# EAGLE design DDS (EAGLE 9.6.2)

## Sheet 1 of 3
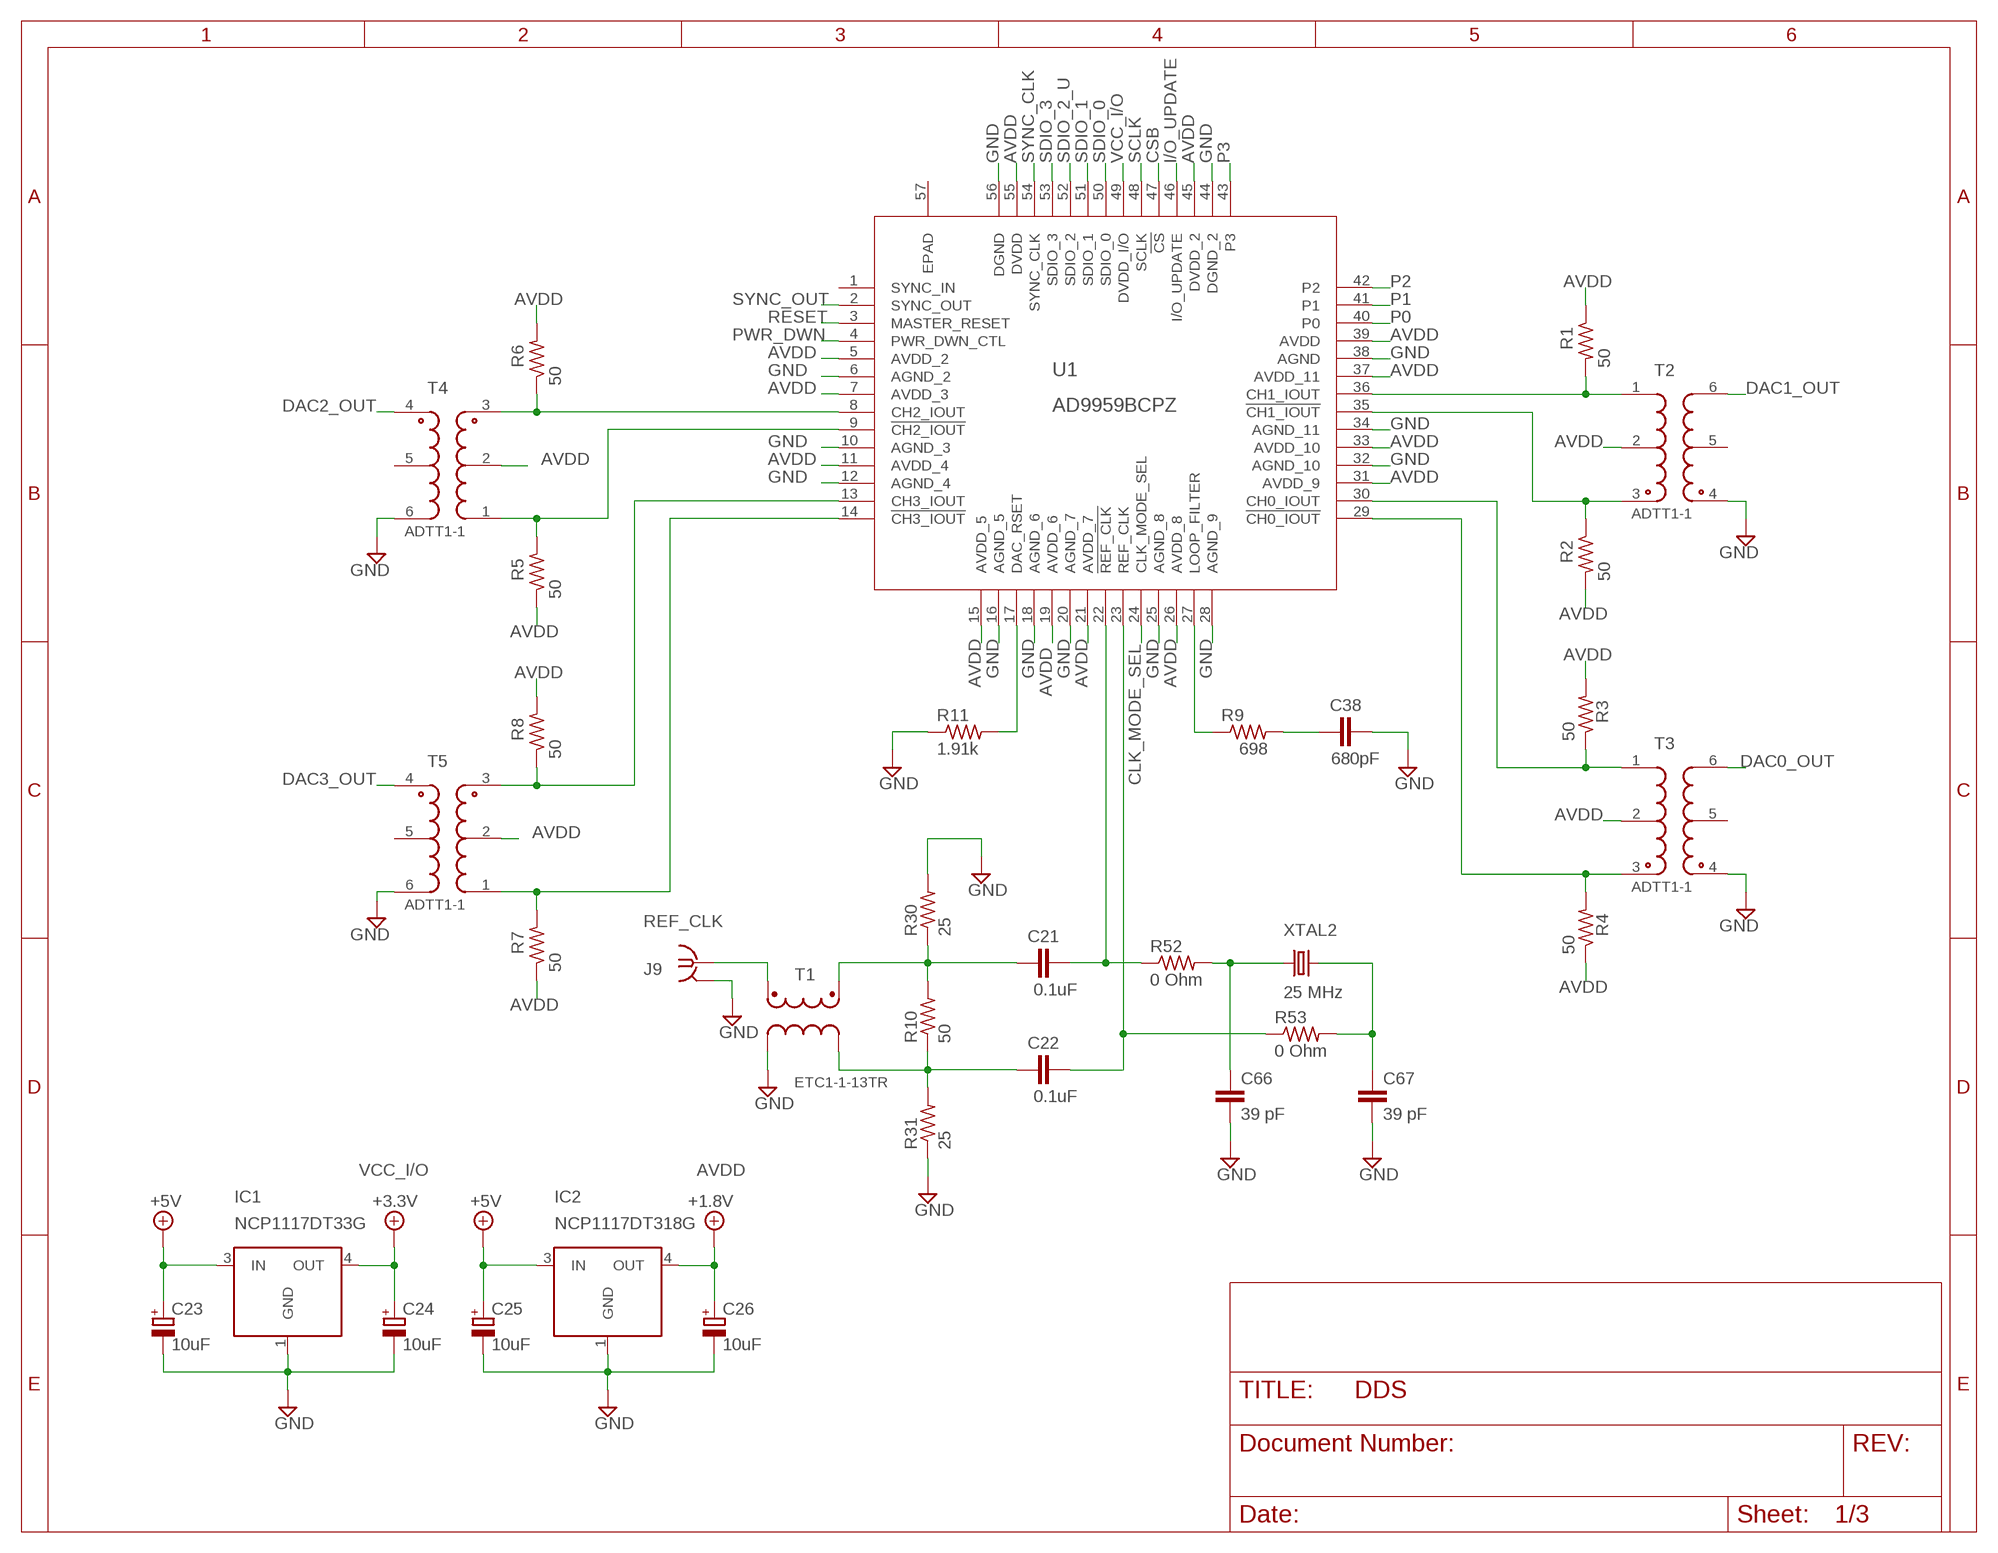
[diagram p0: schematic, sheet 1]

### Parts
C21  0.1uF  C-EUC0402  [C0402]
C22  0.1uF  C-EUC0402  [C0402]
C23  10uF  CPOL-EUCT3528  [CT3528]
C24  10uF  CPOL-EUCT3528  [CT3528]
C25  10uF  CPOL-EUCT3528  [CT3528]
C26  10uF  CPOL-EUCT3528  [CT3528]
C38  680pF  C-EUC0805  [C0805]
C66  39 pF  C-EUC0805  [C0805]
C67  39 pF  C-EUC0805  [C0805]
IC1  NCP1117DT33G  NCP1117DT  [D-PAK_TO252AA]
IC2  NCP1117DT318G  NCP1117DT  [D-PAK_TO252AA]
J9  REF_CLK  BU-SMA-V  [BU-SMA-V]
R1  50  R-US_R0603  [R0603]
R2  50  R-US_R0603  [R0603]
R3  50  R-US_R0603  [R0603]
R4  50  R-US_R0603  [R0603]
R5  50  R-US_R0603  [R0603]
R6  50  R-US_R0603  [R0603]
R7  50  R-US_R0603  [R0603]
R8  50  R-US_R0603  [R0603]
R9  698  R-US_R0603  [R0603]
R10  50  R-US_R0603  [R0603]
R11  1.91k  R-US_R0603  [R0603]
R30  25  R-US_R0402  [R0402]
R31  25  R-US_R0402  [R0402]
R52  0 Ohm  R-US_R0402  [R0402]
R53  0 Ohm  R-US_R0402  [R0402]
T1  ETC1-1-13TR  [SM22]
T2  ADTT1-1  [ADTT]
T3  ADTT1-1  [ADTT]
T4  ADTT1-1  [ADTT]
T5  ADTT1-1  [ADTT]
U1  AD9959BCPZ  [CP_56_1_ADI]
XTAL2  25 MHz  CRYSTALHC49UP  [HC49UP]

### Nets
+5V: C23.+ C25.+ IC1.3(IN) IC2.3(IN) ; also sheet 2
AVDD [1.8V]: C26.+ IC2.4(OUT) R1.1 R2.2 R3.2 R4.1 R5.1 R6.2 R7.1 R8.2 T2.2(PRI0) T3.2(PRI0) T4.2(PRI0) T5.2(PRI0) U1.5(AVDD_2) U1.7(AVDD_3) U1.11(AVDD_4) U1.15(AVDD_5) U1.19(AVDD_6) U1.21(AVDD_7) U1.26(AVDD_8) U1.31(AVDD_9) U1.33(AVDD_10) U1.37(AVDD_11) U1.39(AVDD) U1.45(DVDD_2) U1.55(DVDD) ; supply symbol labelled +1.8V ; also sheet 2,3
CLK_MODE_SEL: U1.24(CLK_MODE_SEL) ; also sheet 2
CSB: U1.47(!CS) ; also sheet 2
DAC0_OUT: T3.6(SEC-) ; also sheet 3
DAC1_OUT: T2.6(SEC-) ; also sheet 3
DAC2_OUT: T4.4(SEC+) ; also sheet 3
DAC3_OUT: T5.4(SEC+) ; also sheet 3
GND: C23.- C24.- C25.- C26.- C38.2 C66.2 C67.2 IC1.1(GND) IC2.1(GND) J9.2(GND) R11.1 R30.2 R31.1 T1.4 T2.4(SEC+) T3.4(SEC+) T4.6(SEC-) T5.6(SEC-) U1.6(AGND_2) U1.10(AGND_3) U1.12(AGND_4) U1.16(AGND_5) U1.18(AGND_6) U1.20(AGND_7) U1.25(AGND_8) U1.28(AGND_9) U1.32(AGND_10) U1.34(AGND_11) U1.38(AGND) U1.44(DGND_2) U1.56(DGND) ; also sheet 2,3
I/O_UPDATE: U1.46(I/O_UPDATE) ; also sheet 2
N$1: C21.1 R10.2 R30.1 T1.1
N$3: R6.1 T4.3(PRI+) U1.8(CH2_IOUT)
N$4: R5.2 T4.1(PRI-) U1.9(!CH2_IOUT)
N$5: R4.2 T3.3(PRI+) U1.29(!CH0_IOUT)
N$6: R1.2 T2.1(PRI-) U1.36(CH1_IOUT)
N$7: R11.2 U1.17(DAC_RSET)
N$8: R9.1 U1.27(LOOP_FILTER)
N$9: C38.1 R9.2
N$11: R7.2 T5.1(PRI-) U1.14(!CH3_IOUT)
N$17: C66.1 R52.2 XTAL2.1
N$21: R3.1 T3.1(PRI-) U1.30(CH0_IOUT)
N$26: C67.1 R53.2 XTAL2.2
N$29: C21.2 R52.1 U1.22(!REF_CLK)
N$31: C22.1 R10.1 R31.2 T1.3
N$32: J9.1 T1.5
N$33: C22.2 R53.1 U1.23(REF_CLK)
N$41: R8.1 T5.3(PRI+) U1.13(CH3_IOUT)
N$45: R2.1 T2.3(PRI+) U1.35(!CH1_IOUT)
P0: U1.40(P0) ; also sheet 2
P1: U1.41(P1) ; also sheet 2
P2: U1.42(P2) ; also sheet 2
P3: U1.43(P3) ; also sheet 2
PWR_DWN: U1.4(PWR_DWN_CTL) ; also sheet 2
RESET: U1.3(MASTER_RESET) ; also sheet 2
SCLK: U1.48(SCLK) ; also sheet 2
SDIO_0: U1.50(SDIO_0) ; also sheet 2
SDIO_1: U1.51(SDIO_1) ; also sheet 2
SDIO_2_U: U1.52(SDIO_2) ; also sheet 2
SDIO_3: U1.53(SDIO_3) ; also sheet 2
SYNC_CLK: U1.54(SYNC_CLK)
SYNC_OUT: U1.2(SYNC_OUT)
VCC_I/O: C24.+ IC1.4(OUT) U1.49(DVDD_I/O) ; supply symbol labelled +3.3V ; also sheet 2,3
Unconnected: T2.5(SEC0) T3.5(SEC0) T4.5(SEC0) T5.5(SEC0) U1.1(SYNC_IN) U1.57(EPAD)

## Sheet 2 of 3
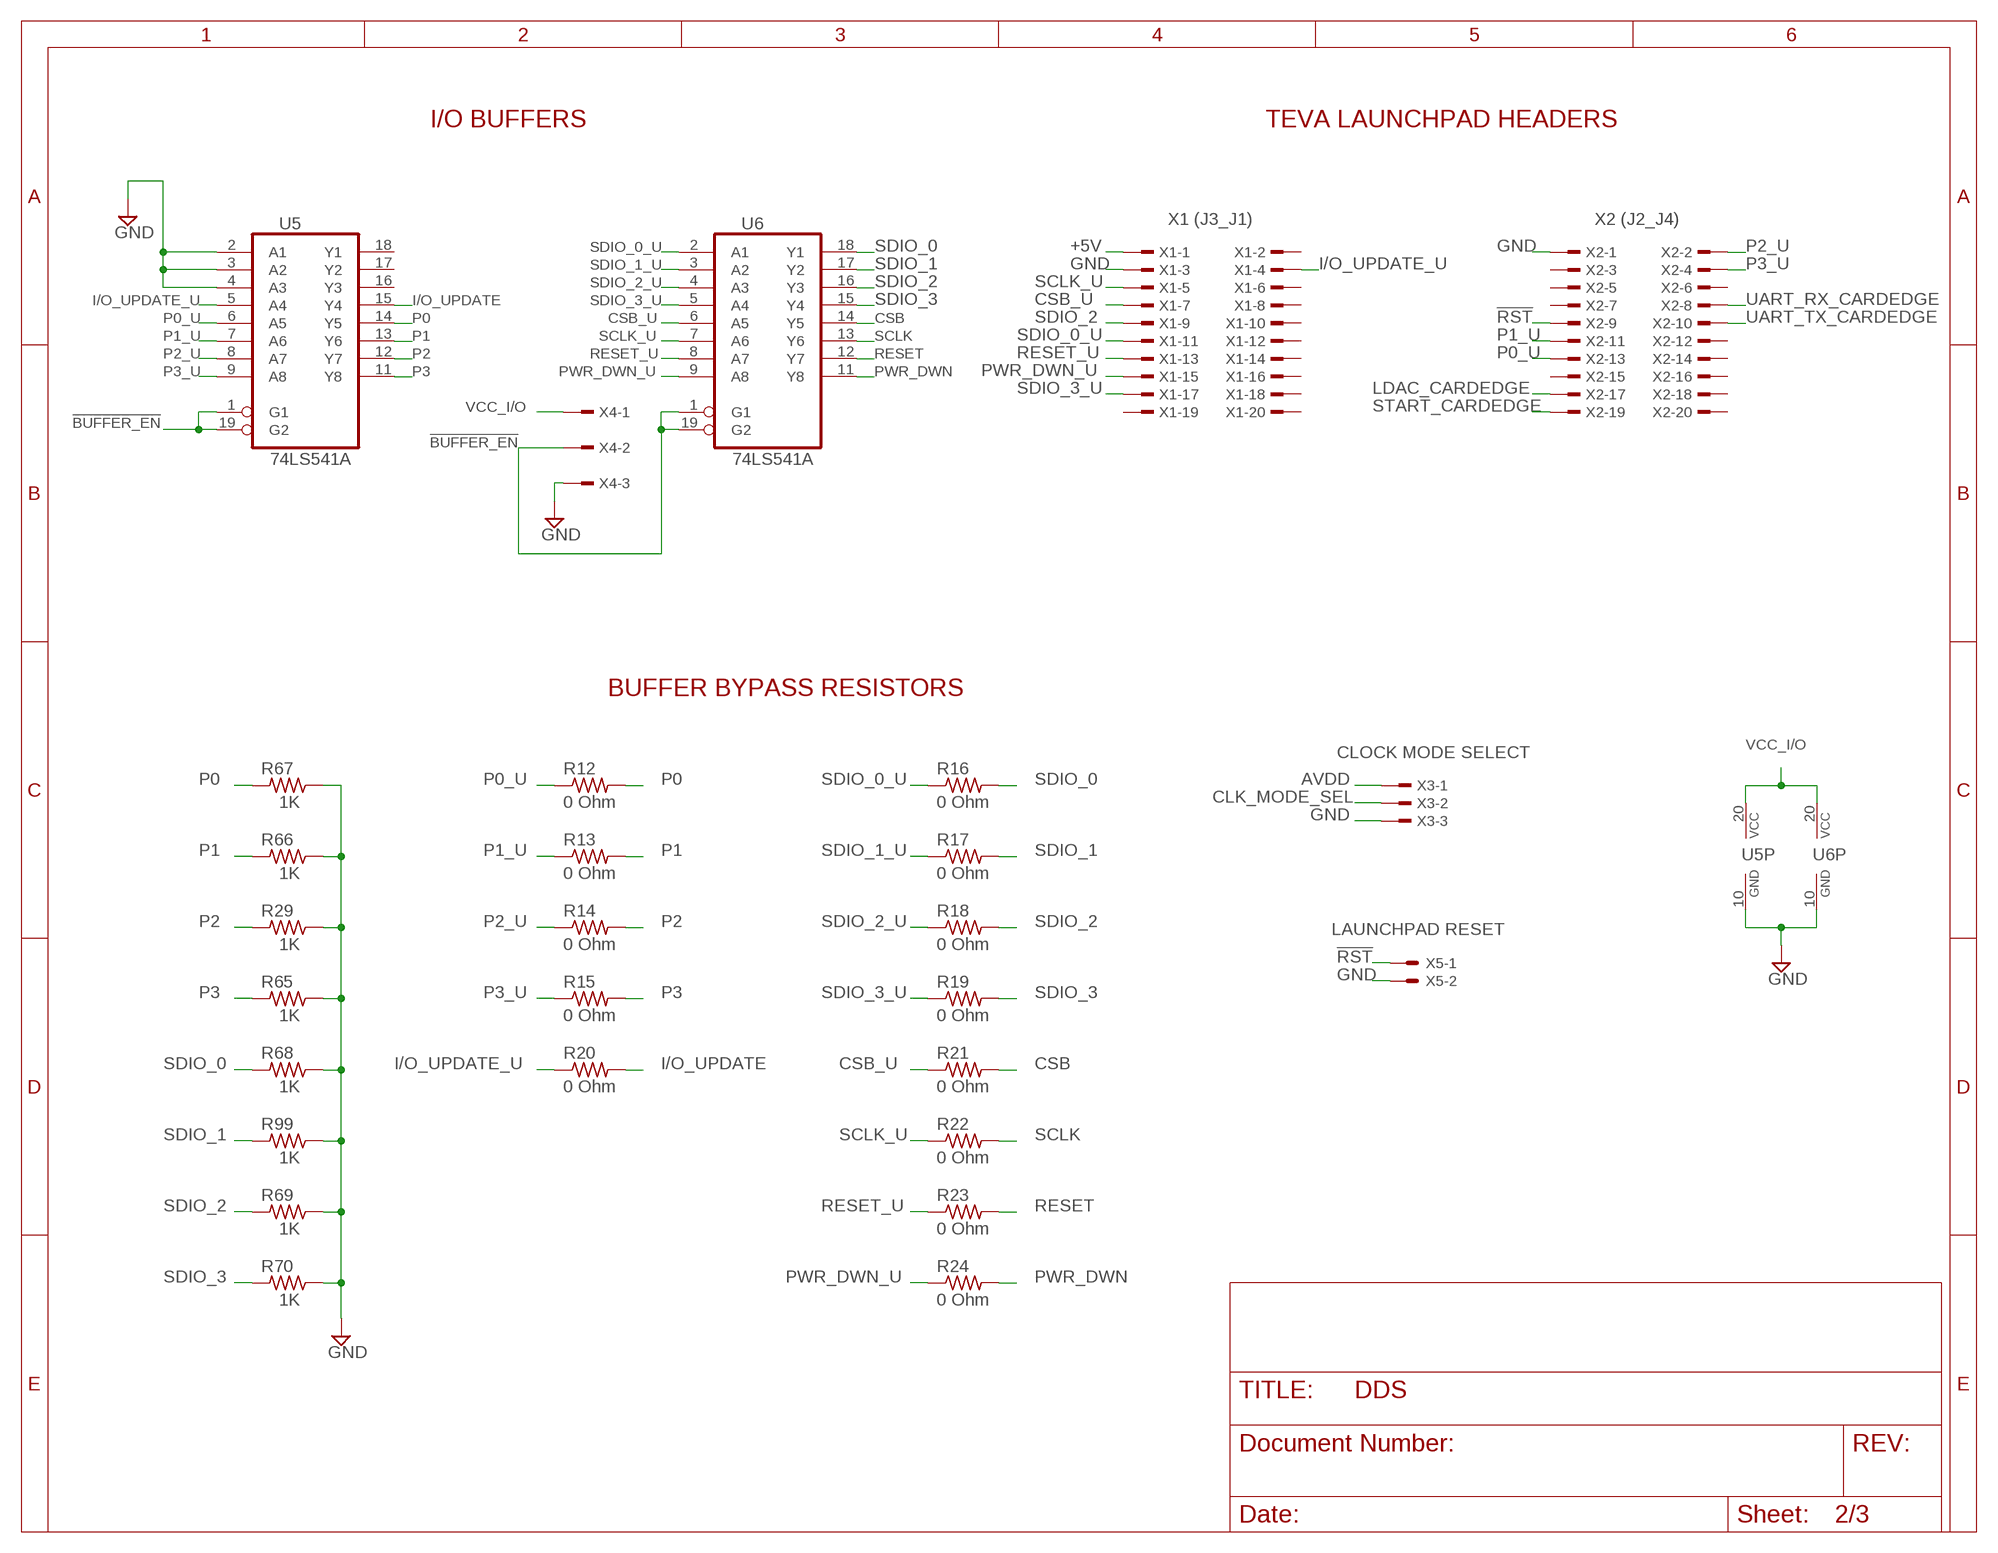
[diagram p1: schematic, sheet 2]

### Parts
R12  0 Ohm  R-US_R0402  [R0402]
R13  0 Ohm  R-US_R0402  [R0402]
R14  0 Ohm  R-US_R0402  [R0402]
R15  0 Ohm  R-US_R0402  [R0402]
R16  0 Ohm  R-US_R0402  [R0402]
R17  0 Ohm  R-US_R0402  [R0402]
R18  0 Ohm  R-US_R0402  [R0402]
R19  0 Ohm  R-US_R0402  [R0402]
R20  0 Ohm  R-US_R0402  [R0402]
R21  0 Ohm  R-US_R0402  [R0402]
R22  0 Ohm  R-US_R0402  [R0402]
R23  0 Ohm  R-US_R0402  [R0402]
R24  0 Ohm  R-US_R0402  [R0402]
R29  1K  R-US_R0603  [R0603]
R65  1K  R-US_R0603  [R0603]
R66  1K  R-US_R0603  [R0603]
R67  1K  R-US_R0603  [R0603]
R68  1K  R-US_R0603  [R0603]
R69  1K  R-US_R0603  [R0603]
R70  1K  R-US_R0603  [R0603]
R99  1K  R-US_R0603  [R0603]
U5  74LS541A  74LS541DW  [SO20W]
U6  74LS541A  74LS541DW  [SO20W]
X1  X1 (J3_J1)  TSW-110-07-G-D  [TSW-110-XX-G-D]
X2  X2 (J2_J4)  TSW-110-07-G-D  [TSW-110-XX-G-D]
X3  CLOCK MODE SELECT  TSW-103-08-G-S  [TSW-103-XX-G-S]
X4  BUFFER  TSW-103-08-G-S  [TSW-103-XX-G-S]
X5  LAUNCHPAD RESET  22-23-2021  [22-23-2021]

### Nets
!BUFFER_EN: U5.1(G1) U5.19(G2) U6.1(G1) U6.19(G2) X4.2
!RST: X2.9 X5.1
+5V: X1.1 ; also sheet 1
AVDD [1.8V]: X3.1 ; also sheet 1,3
CLK_MODE_SEL: X3.2 ; also sheet 1
CSB: R21.2 U6.14(Y5) ; also sheet 1
CSB_U: R21.1 U6.6(A5) X1.7
GND: R29.1 R65.1 R66.1 R67.1 R68.1 R69.1 R70.1 R99.1 U5.2(A1) U5.3(A2) U5.4(A3) U5.10(GND) U6.10(GND) X1.3 X2.1 X3.3 X4.3 X5.2 ; also sheet 1,3
I/O_UPDATE: R20.2 U5.15(Y4) ; also sheet 1
I/O_UPDATE_U: R20.1 U5.5(A4) X1.4
LDAC_CARDEDGE: X2.17
P0: R12.2 R67.2 U5.14(Y5) ; also sheet 1
P0_U: R12.1 U5.6(A5) X2.13
P1: R13.2 R66.2 U5.13(Y6) ; also sheet 1
P1_U: R13.1 U5.7(A6) X2.11
P2: R14.2 R29.2 U5.12(Y7) ; also sheet 1
P2_U: R14.1 U5.8(A7) X2.2
P3: R15.2 R65.2 U5.11(Y8) ; also sheet 1
P3_U: R15.1 U5.9(A8) X2.4
PWR_DWN: R24.2 U6.11(Y8) ; also sheet 1
PWR_DWN_U: R24.1 U6.9(A8) X1.15
RESET: R23.2 U6.12(Y7) ; also sheet 1
RESET_U: R23.1 U6.8(A7) X1.13
SCLK: R22.2 U6.13(Y6) ; also sheet 1
SCLK_U: R22.1 U6.7(A6) X1.5
SDIO_0: R16.2 R68.2 U6.18(Y1) ; also sheet 1
SDIO_0_U: R16.1 U6.2(A1) X1.11
SDIO_1: R17.2 R99.2 U6.17(Y2) ; also sheet 1
SDIO_1_U: R17.1 U6.3(A2)
SDIO_2: R18.2 R69.2 U6.16(Y3) X1.9
SDIO_2_U: R18.1 U6.4(A3) ; also sheet 1
SDIO_3: R19.2 R70.2 U6.15(Y4) ; also sheet 1
SDIO_3_U: R19.1 U6.5(A4) X1.17
START_CARDEDGE: X2.19
UART_RX_CARDEDGE: X2.8
UART_TX_CARDEDGE: X2.10
VCC_I/O: U5.20(VCC) U6.20(VCC) X4.1 ; also sheet 1,3
Unconnected: U5.16(Y3) U5.17(Y2) U5.18(Y1) X1.2 X1.6 X1.8 X1.10 X1.12 X1.14 X1.16 X1.18 X1.19 X1.20 X2.3 X2.5 X2.6 X2.7 X2.12 X2.14 X2.15 X2.16 X2.18 X2.20

### Notes on the sheet
- I/O BUFFERS | TEVA LAUNCHPAD HEADERS
- BUFFER BYPASS RESISTORS

## Sheet 3 of 3
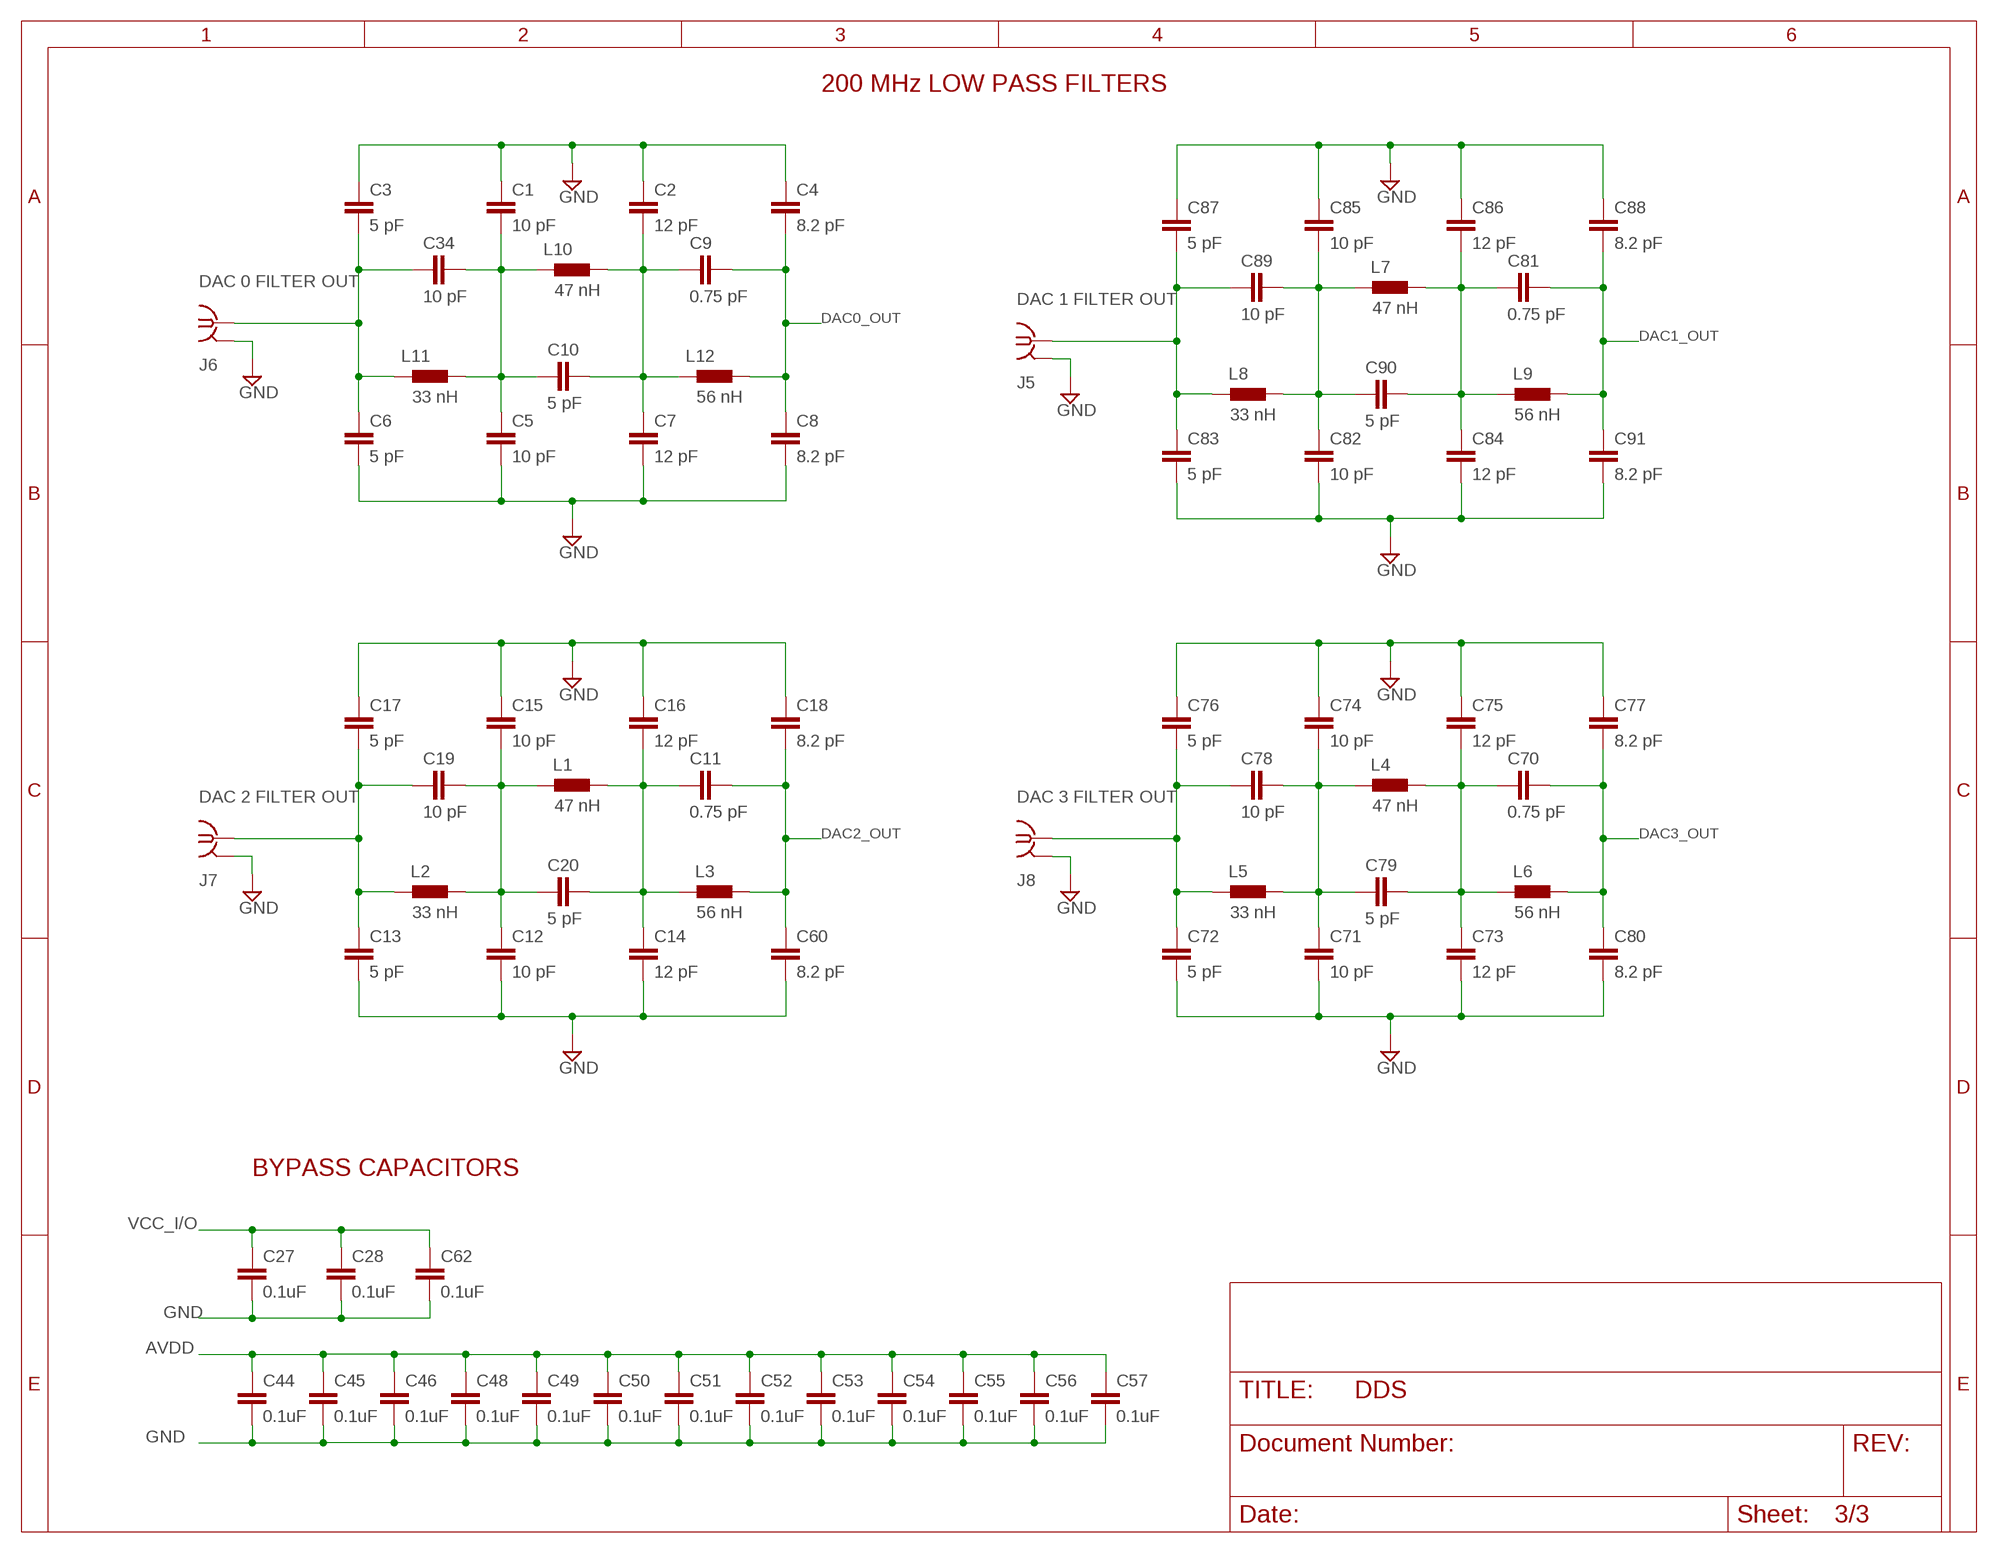
[diagram p2: schematic, sheet 3]

### Parts
C1  10 pF  C-EUC0402  [C0402]
C2  12 pF  C-EUC0402  [C0402]
C3  5 pF  C-EUC0402  [C0402]
C4  8.2 pF  C-EUC0402  [C0402]
C5  10 pF  C-EUC0402  [C0402]
C6  5 pF  C-EUC0402  [C0402]
C7  12 pF  C-EUC0402  [C0402]
C8  8.2 pF  C-EUC0402  [C0402]
C9  0.75 pF  C-EUC0402  [C0402]
C10  5 pF  C-EUC0402  [C0402]
C11  0.75 pF  C-EUC0402  [C0402]
C12  10 pF  C-EUC0402  [C0402]
C13  5 pF  C-EUC0402  [C0402]
C14  12 pF  C-EUC0402  [C0402]
C15  10 pF  C-EUC0402  [C0402]
C16  12 pF  C-EUC0402  [C0402]
C17  5 pF  C-EUC0402  [C0402]
C18  8.2 pF  C-EUC0402  [C0402]
C19  10 pF  C-EUC0402  [C0402]
C20  5 pF  C-EUC0402  [C0402]
C27  0.1uF  C-EUC0603  [C0603]
C28  0.1uF  C-EUC0603  [C0603]
C34  10 pF  C-EUC0402  [C0402]
C44  0.1uF  C-EUC0402  [C0402]
C45  0.1uF  C-EUC0402  [C0402]
C46  0.1uF  C-EUC0402  [C0402]
C48  0.1uF  C-EUC0402  [C0402]
C49  0.1uF  C-EUC0402  [C0402]
C50  0.1uF  C-EUC0402  [C0402]
C51  0.1uF  C-EUC0402  [C0402]
C52  0.1uF  C-EUC0402  [C0402]
C53  0.1uF  C-EUC0402  [C0402]
C54  0.1uF  C-EUC0402  [C0402]
C55  0.1uF  C-EUC0402  [C0402]
C56  0.1uF  C-EUC0402  [C0402]
C57  0.1uF  C-EUC0402  [C0402]
C60  8.2 pF  C-EUC0402  [C0402]
C62  0.1uF  C-EUC0402  [C0402]
C70  0.75 pF  C-EUC0402  [C0402]
C71  10 pF  C-EUC0402  [C0402]
C72  5 pF  C-EUC0402  [C0402]
C73  12 pF  C-EUC0402  [C0402]
C74  10 pF  C-EUC0402  [C0402]
C75  12 pF  C-EUC0402  [C0402]
C76  5 pF  C-EUC0402  [C0402]
C77  8.2 pF  C-EUC0402  [C0402]
C78  10 pF  C-EUC0402  [C0402]
C79  5 pF  C-EUC0402  [C0402]
C80  8.2 pF  C-EUC0402  [C0402]
C81  0.75 pF  C-EUC0402  [C0402]
C82  10 pF  C-EUC0402  [C0402]
C83  5 pF  C-EUC0402  [C0402]
C84  12 pF  C-EUC0402  [C0402]
C85  10 pF  C-EUC0402  [C0402]
C86  12 pF  C-EUC0402  [C0402]
C87  5 pF  C-EUC0402  [C0402]
C88  8.2 pF  C-EUC0402  [C0402]
C89  10 pF  C-EUC0402  [C0402]
C90  5 pF  C-EUC0402  [C0402]
C91  8.2 pF  C-EUC0402  [C0402]
J5  DAC 1 FILTER OUT  BU-SMA-V  [BU-SMA-V]
J6  DAC 0 FILTER OUT  BU-SMA-V  [BU-SMA-V]
J7  DAC 2 FILTER OUT  BU-SMA-V  [BU-SMA-V]
J8  DAC 3 FILTER OUT  BU-SMA-V  [BU-SMA-V]
L1  47 nH  BLM15HB121SN1  [0402]
L2  33 nH  BLM15HB121SN1  [0402]
L3  56 nH  BLM15HB121SN1  [0402]
L4  47 nH  BLM15HB121SN1  [0402]
L5  33 nH  BLM15HB121SN1  [0402]
L6  56 nH  BLM15HB121SN1  [0402]
L7  47 nH  BLM15HB121SN1  [0402]
L8  33 nH  BLM15HB121SN1  [0402]
L9  56 nH  BLM15HB121SN1  [0402]
L10  47 nH  BLM15HB121SN1  [0402]
L11  33 nH  BLM15HB121SN1  [0402]
L12  56 nH  BLM15HB121SN1  [0402]

### Nets
AVDD [1.8V]: C44.1 C45.1 C46.1 C48.1 C49.1 C50.1 C51.1 C52.1 C53.1 C54.1 C55.1 C56.1 C57.1 ; also sheet 1,2
DAC0_OUT: C4.2 C8.1 C9.1 L12.2 ; also sheet 1
DAC1_OUT: C81.1 C88.2 C91.1 L9.2 ; also sheet 1
DAC2_OUT: C11.1 C18.2 C60.1 L3.2 ; also sheet 1
DAC3_OUT: C70.1 C77.2 C80.1 L6.2 ; also sheet 1
GND: C1.1 C2.1 C3.1 C4.1 C5.2 C6.2 C7.2 C8.2 C12.2 C13.2 C14.2 C15.1 C16.1 C17.1 C18.1 C27.2 C28.2 C44.2 C45.2 C46.2 C48.2 C49.2 C50.2 C51.2 C52.2 C53.2 C54.2 C55.2 C56.2 C57.2 C60.2 C62.2 C71.2 C72.2 C73.2 C74.1 C75.1 C76.1 C77.1 C80.2 C82.2 C83.2 C84.2 C85.1 C86.1 C87.1 C88.1 C91.2 J5.2(GND) J6.2(GND) J7.2(GND) J8.2(GND) ; also sheet 1,2
N$13: C81.2 C84.1 C86.2 C90.1 L7.2 L9.1
N$15: C83.1 C87.2 C89.2 J5.1 L8.1
N$16: C82.1 C85.2 C89.1 C90.2 L7.1 L8.2
N$34: C13.1 C17.2 C19.2 J7.1 L2.1
N$35: C2.2 C7.1 C9.2 C10.1 L10.2 L12.1
N$36: C3.2 C6.1 C34.2 J6.1 L11.1
N$37: C1.2 C5.1 C10.2 C34.1 L10.1 L11.2
N$48: C11.2 C14.1 C16.2 C20.1 L1.2 L3.1
N$50: C12.1 C15.2 C19.1 C20.2 L1.1 L2.2
N$56: C70.2 C73.1 C75.2 C79.1 L4.2 L6.1
N$57: C72.1 C76.2 C78.2 J8.1 L5.1
N$58: C71.1 C74.2 C78.1 C79.2 L4.1 L5.2
VCC_I/O: C27.1 C28.1 C62.1 ; also sheet 1,2

### Notes on the sheet
- 200 MHz LOW PASS FILTERS
- BYPASS CAPACITORS

## Power pins joined to a net without a drawn wire
GND: J5.3(GND) J5.4(GND) J5.5(GND) J6.3(GND) J6.4(GND) J6.5(GND) J7.3(GND) J7.4(GND) J7.5(GND) J8.3(GND) J8.4(GND) J8.5(GND) J9.3(GND) J9.4(GND) J9.5(GND)

## Library data of the parts
C1 C5 C12 C15 C19 C34 C71 C74 C78 C82 C85 C89 = rcl:C-EU: CAPACITOR, European symbol; MF: SAMSUNG ELECTRO-MECHANICS; MPN: CL05C100JB5NNNC; OC_NEWARK: 82AC9241; SPICEPREFIX: C
C2 C7 C14 C16 C73 C75 C84 C86 = rcl:C-EU: CAPACITOR, European symbol; MF: AVX; MPN: 04025A120JAT2A; OC_NEWARK: 96M1132; SPICEPREFIX: C
C3 C6 C10 C13 C17 C20 C72 C76 C79 C83 C87 C90 = rcl:C-EU: CAPACITOR, European symbol; MF: MURATA; MPN: GJM1555C1H5R0CB01D; OC_NEWARK: 13AJ0434; SPICEPREFIX: C
C4 C8 C18 C60 C77 C80 C88 C91 = rcl:C-EU: CAPACITOR, European symbol; MF: AVX; MPN: 04025A8R2BAT2A; OC_NEWARK: 96Y8184; SPICEPREFIX: C
C9 C11 C70 C81 = rcl:C-EU: CAPACITOR, European symbol; MF: MURATA; MPN: GJM1555C1HR75BB01D; OC_NEWARK: 66AH5898; SPICEPREFIX: C
C21 C22 C44-C46 C48-C57 C62 = rcl:C-EU: CAPACITOR, European symbol; MF: KEMET; MPN: C0402C104K4RACTU; OC_NEWARK: 70K9077; SPICEPREFIX: C
C23-C26 = rcl:CPOL-EU: POLARIZED CAPACITOR, European symbol; MF: KEMET; MPN: T494B106K025AT; OC_NEWARK: 94W4791; SPICEPREFIX: C
C27 C28 = rcl:C-EU: CAPACITOR, European symbol; MF: AVX; MPN: 06035C104KAT2A; OC_NEWARK: 54K2412; SPICEPREFIX: C
C38 = rcl:C-EU: CAPACITOR, European symbol; MF: MULTICOMP PRO; MPN: MC0805N681J101CT; OC_NEWARK: 33R0627; SPICEPREFIX: C
C66 C67 = rcl:C-EU: CAPACITOR, European symbol; MF: MULTICOMP PRO; MPN: MC0805N390J500CT; OC_NEWARK: 06R4098; SPICEPREFIX: C
IC1 = Custom:NCP1117DT; MF: ON SEMICONDUCTOR; MPN: NCP1117DT33G; OC_NEWARK: 71J6562
IC2 = Custom:NCP1117DT; MF: ON SEMICONDUCTOR; MPN: NCP1117DT18G; OC_NEWARK: 71J6561
J5-J9 = lasser:BU-SMA-V: FEMALE SMA CONNECTOR Radiall distributor RS 112-3794; MF: JOHNSON - CINCH CONNECTIVITY; MPN: 142-0701-231; OC_NEWARK: 08B888
L1 L4 L7 L10 = inductors:BLM15H: EMIFIL (R) Chip Ferrite Bead for GHz Noise Source: http://www.murata.com/ Ferrite Bead BLM15H.pdf; MF: MURATA; MPN: LQG15HN47NJ02D; OC_NEWARK: 42M2099
L2 L5 L8 L11 = inductors:BLM15H: EMIFIL (R) Chip Ferrite Bead for GHz Noise Source: http://www.murata.com/ Ferrite Bead BLM15H.pdf; MF: MURATA; MPN: LQG15HS33NJ02D; OC_NEWARK: 76AH5386
L3 L6 L9 L12 = inductors:BLM15H: EMIFIL (R) Chip Ferrite Bead for GHz Noise Source: http://www.murata.com/ Ferrite Bead BLM15H.pdf; MF: MURATA; MPN: LQG15HS56NJ02D; OC_NEWARK: 76AH5390
R1-R8 R10 = rcl:R-US_: RESISTOR, American symbol; MF: VISHAY; MPN: CRCW060350R0FKEA; OC_NEWARK: 89M6778; SPICEPREFIX: R
R9 = rcl:R-US_: RESISTOR, American symbol; MF: PANASONIC; MPN: ERJ-3EKF6980V; OC_NEWARK: 65T8512; SPICEPREFIX: R
R11 = rcl:R-US_: RESISTOR, American symbol; MF: VISHAY; MPN: CRCW06031K91FKEA; OC_NEWARK: 52K8050; SPICEPREFIX: R
R12-R24 R52 R53 = rcl:R-US_: RESISTOR, American symbol; MF: PANASONIC; MPN: ERJ2GE0R00X; OC_NEWARK: 63W0591; SPICEPREFIX: R
R29 R65-R70 R99 = rcl:R-US_: RESISTOR, American symbol; MF: PANASONIC; MPN: ERJ-3EKF1001V; OC_NEWARK: 64R5308; SPICEPREFIX: R
R30 R31 = rcl:R-US_: RESISTOR, American symbol; MF: NIC COMPONENTS; MPN: NRC04F24R9TRF; OC_NEWARK: 08AH7515; SPICEPREFIX: R
T1 = ETC1-1-13TR:ETC1-1-13TR: RF 1:1 Transmission Line Transformer 4.5 - 3000 MHz; AVAILABILITY: Unavailable; DESCRIPTION: RF Balun 4.5MHz ~ 3GHz 1:1 5-SMD; MP: ETC1-1-13TR; OC_NEWARK: unknown; PACKAGE: SMD-5 MA-COM; PRICE: None
T2-T5 = ADTT1-1:ADTT1-1: Minicircuits ADTT1-1 Surface Mount RF Transformer 50?, 0.3 to 300 MHz; AVAILABILITY: Unavailable; DESCRIPTION: Xfmr, Isolation, 50 ohm, 1: 1, 0.3-300 MHz, SMT; MP: ADTT1-1+; OC_NEWARK: unknown; PACKAGE: None; PRICE: None
U1 = AD9959:AD9959BCPZ; BUILT_BY: EMA_UL_Team; MANUFACTURER_PART_NUMBER: AD9959BCPZ; OC_NEWARK: unknown; SOURCELIBRARY: Analog_2015-01-06; VENDOR: Analog Devices Inc
U5 U6 = 74xx-eu:74*541: Octal BUFFER and LINE DRIVER, 3-state; MF: TEXAS INSTRUMENTS; MPN: SN74LVC541APW; OC_NEWARK: 29AH7649
X1 X2 = con-samtec:TSW-110-*-G: THROUGH-HOLE .025" SQ POST HEADER Source: Samtec TSW.pdf; OC_NEWARK: unknown
X3 X4 = con-samtec:TSW-103-*-G-S: THROUGH-HOLE .025" SQ POST HEADER Source: Samtec TSW.pdf; OC_NEWARK: unknown
X5 = con-molex:22-23-2021: .100" (2.54mm) Center Header - 2 Pin; MF: MOLEX; MPN: 22-23-2021; OC_FARNELL: 1462926; OC_NEWARK: 25C3832
XTAL2 = crystal:CRYSTAL: CRYSTAL; OC_FARNELL: unknown; OC_NEWARK: unknown

## Board
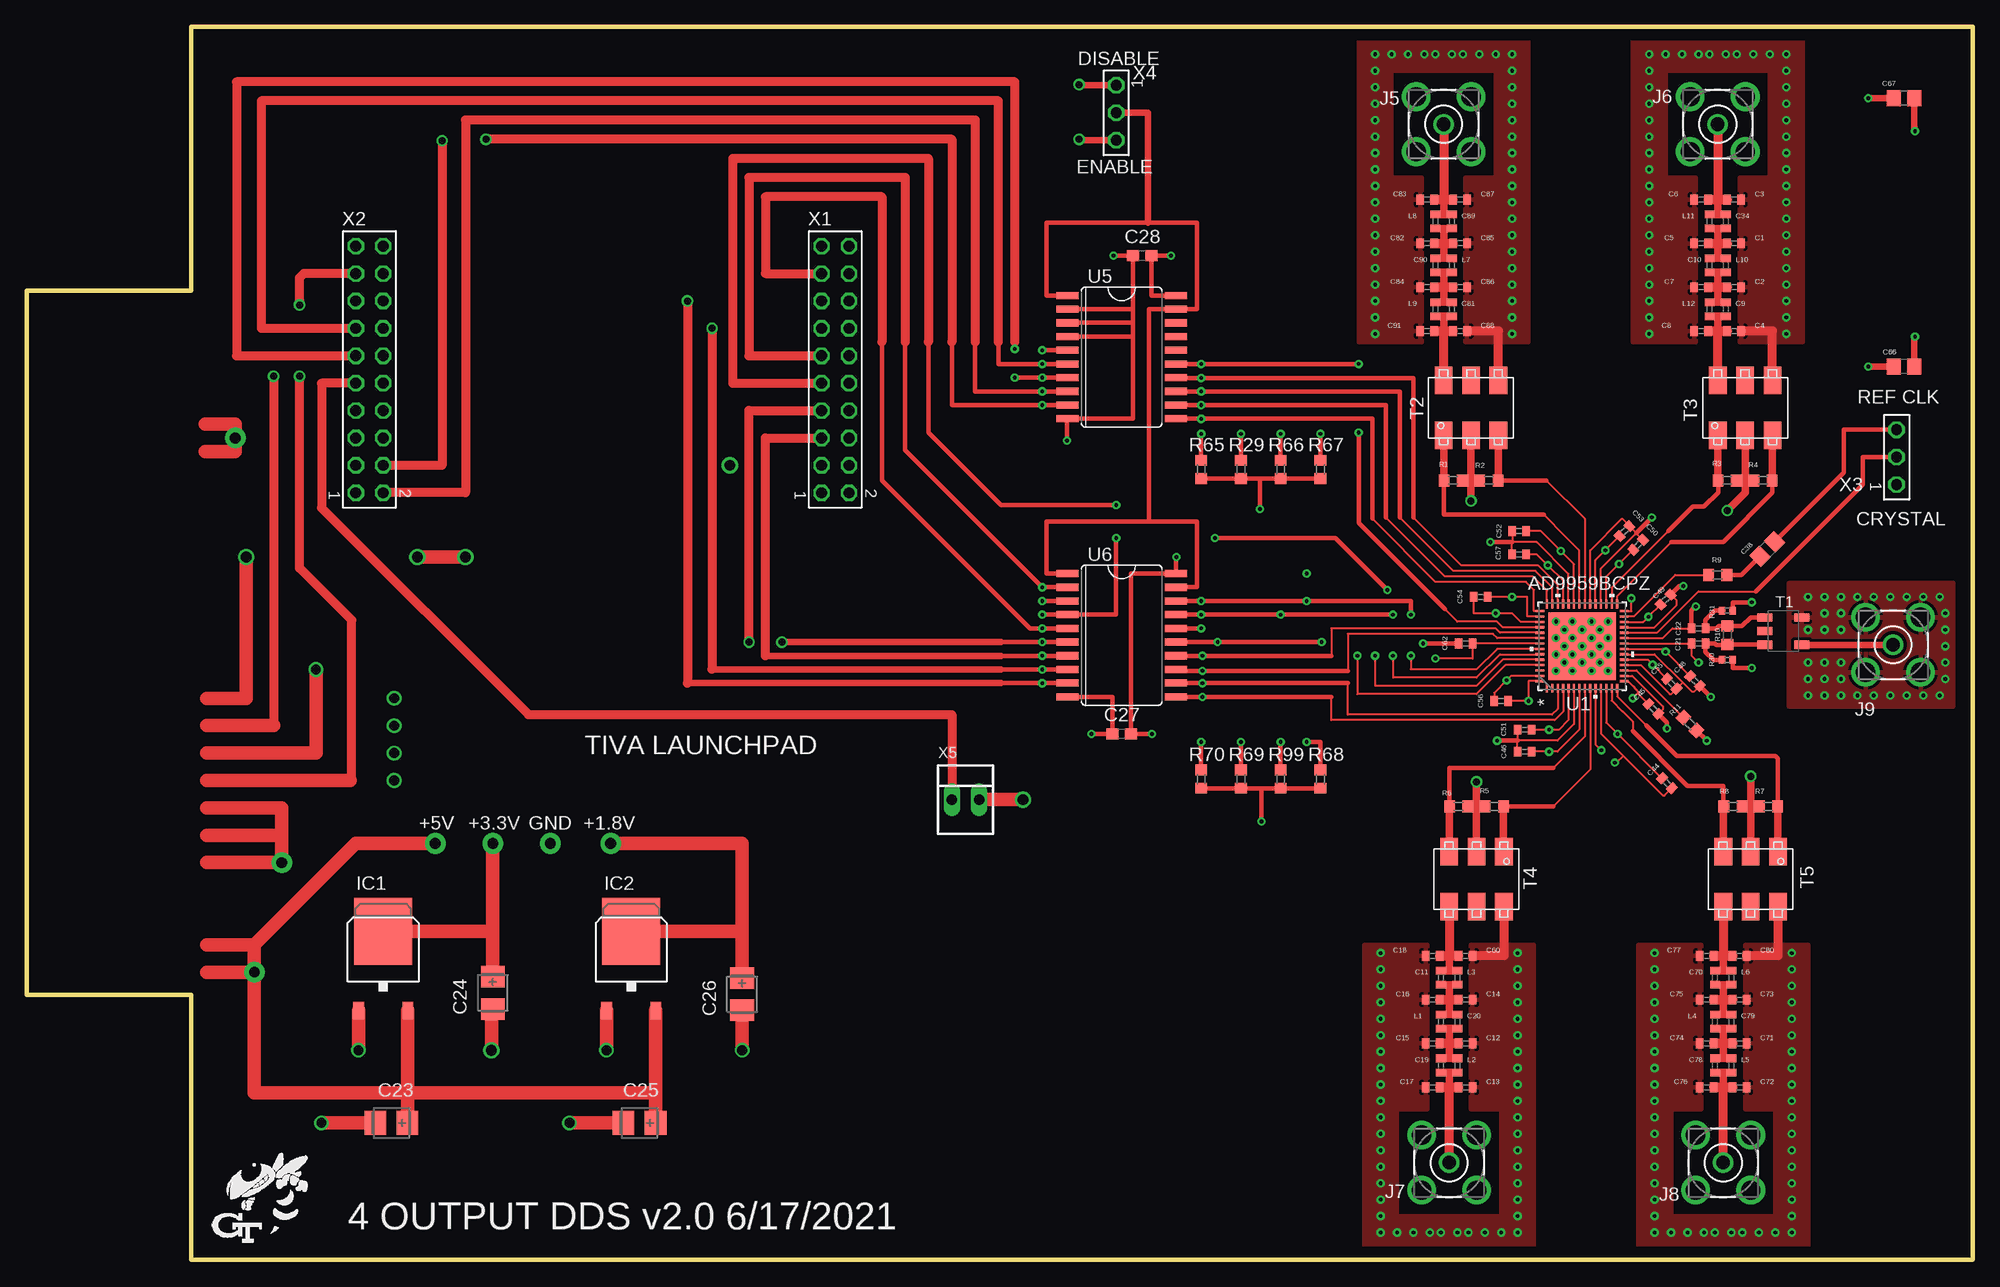
[diagram p3: board, top side]
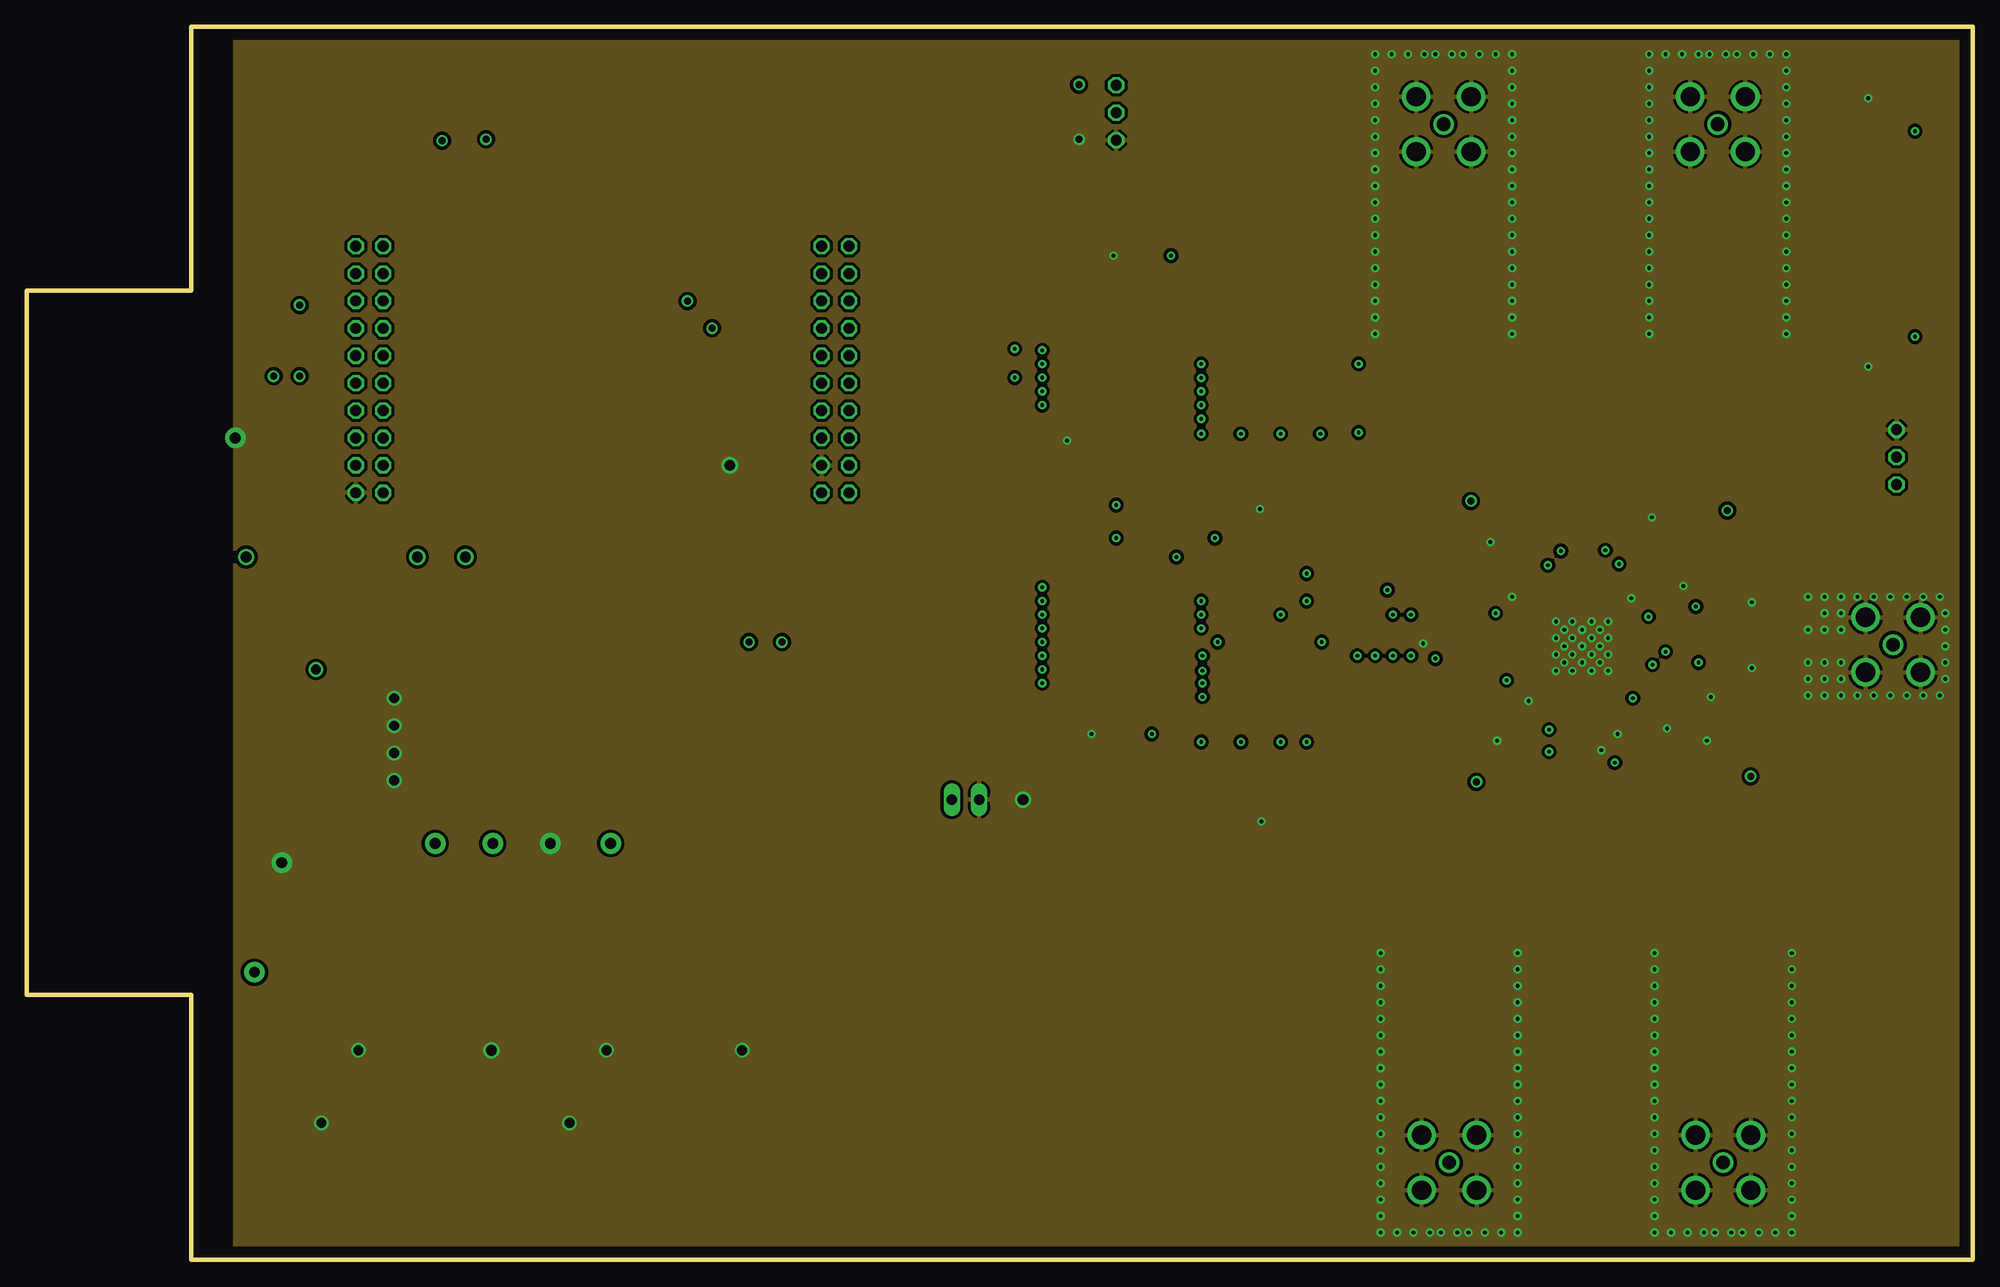
[diagram p4: board, inner layer Route2]
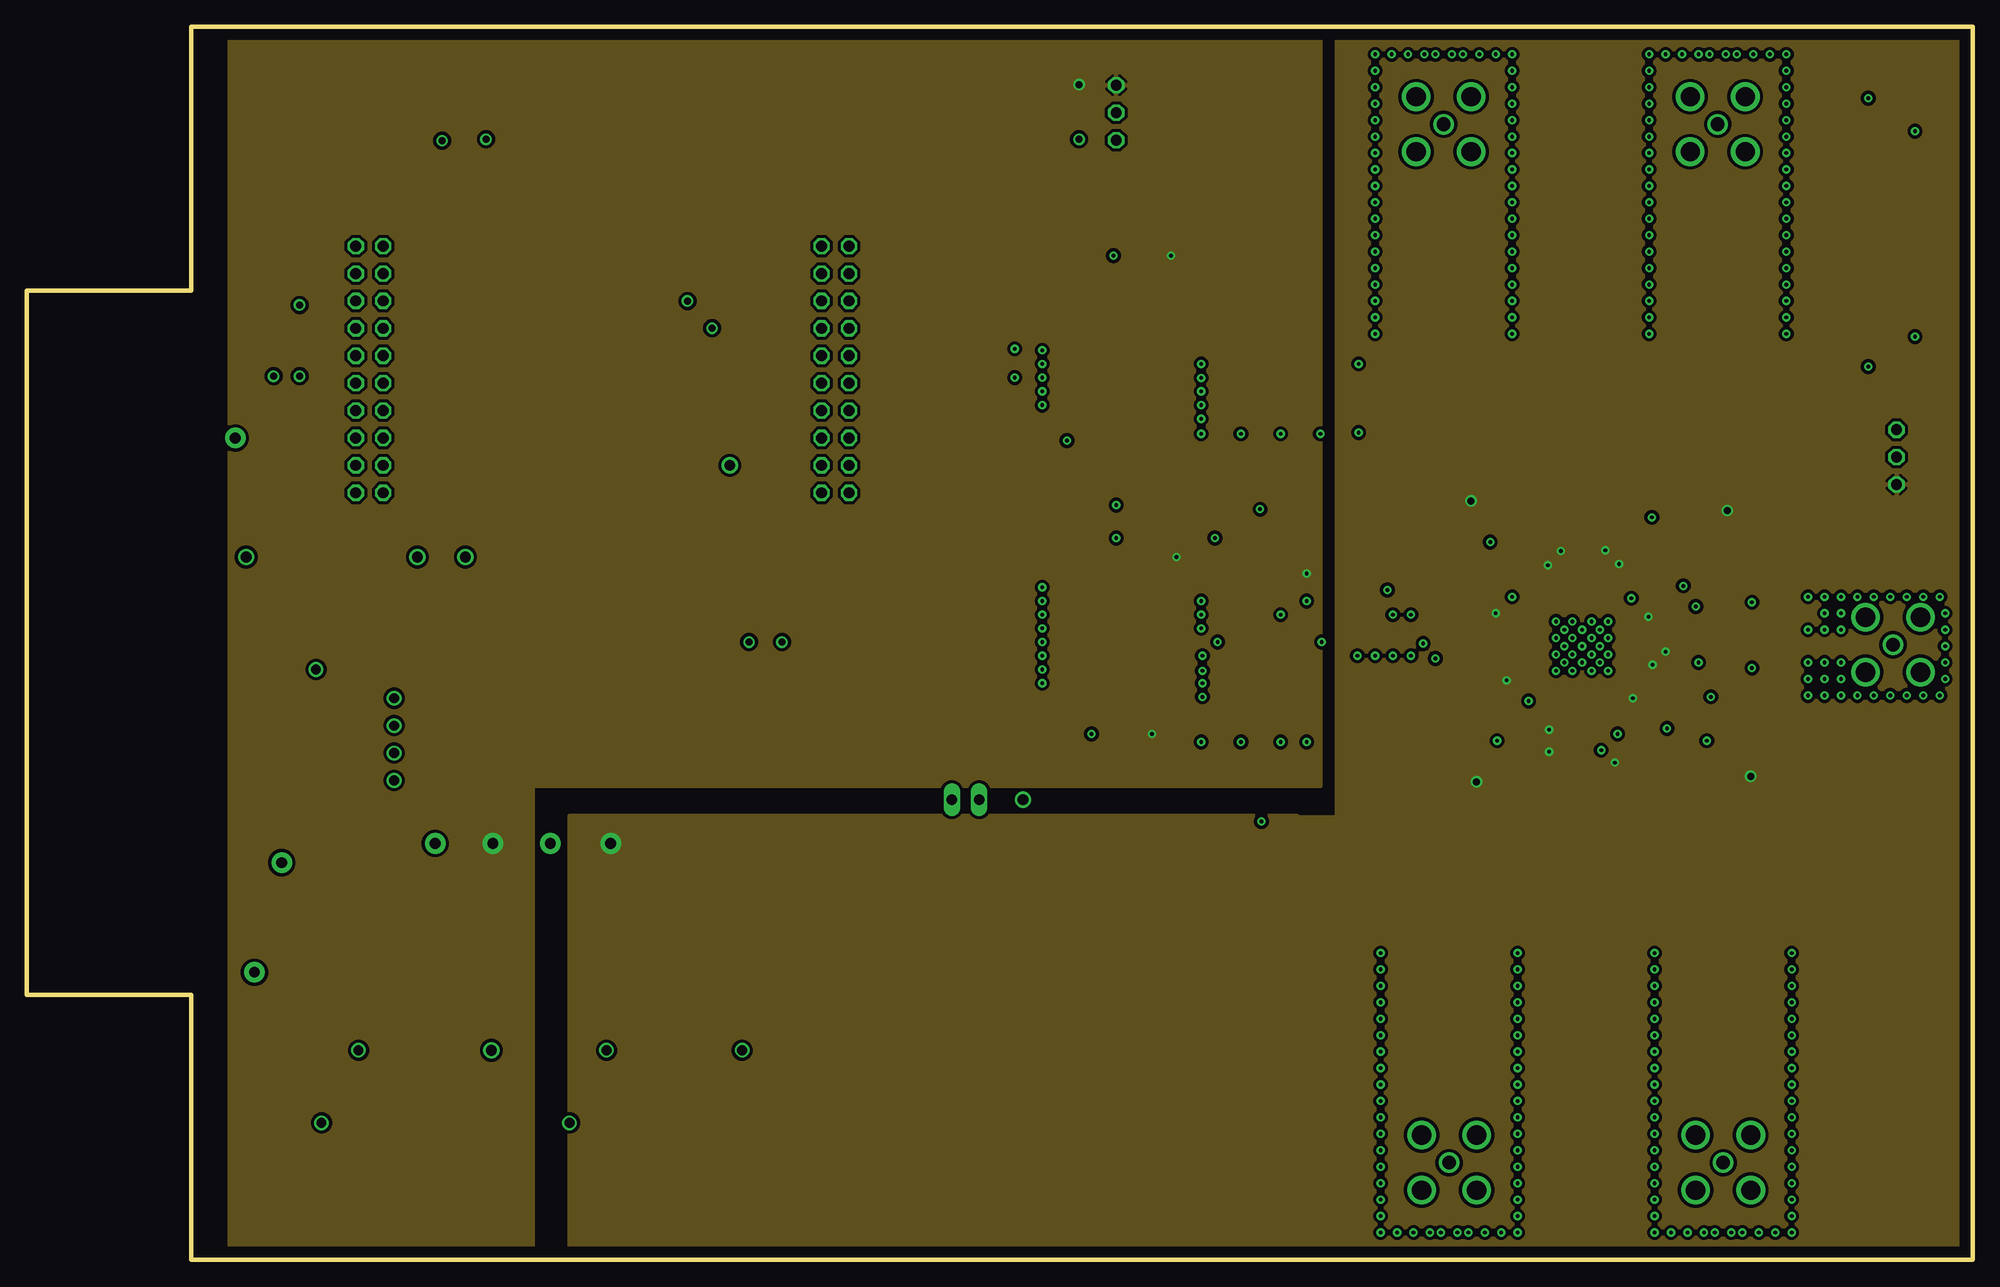
[diagram p5: board, inner layer Route15]
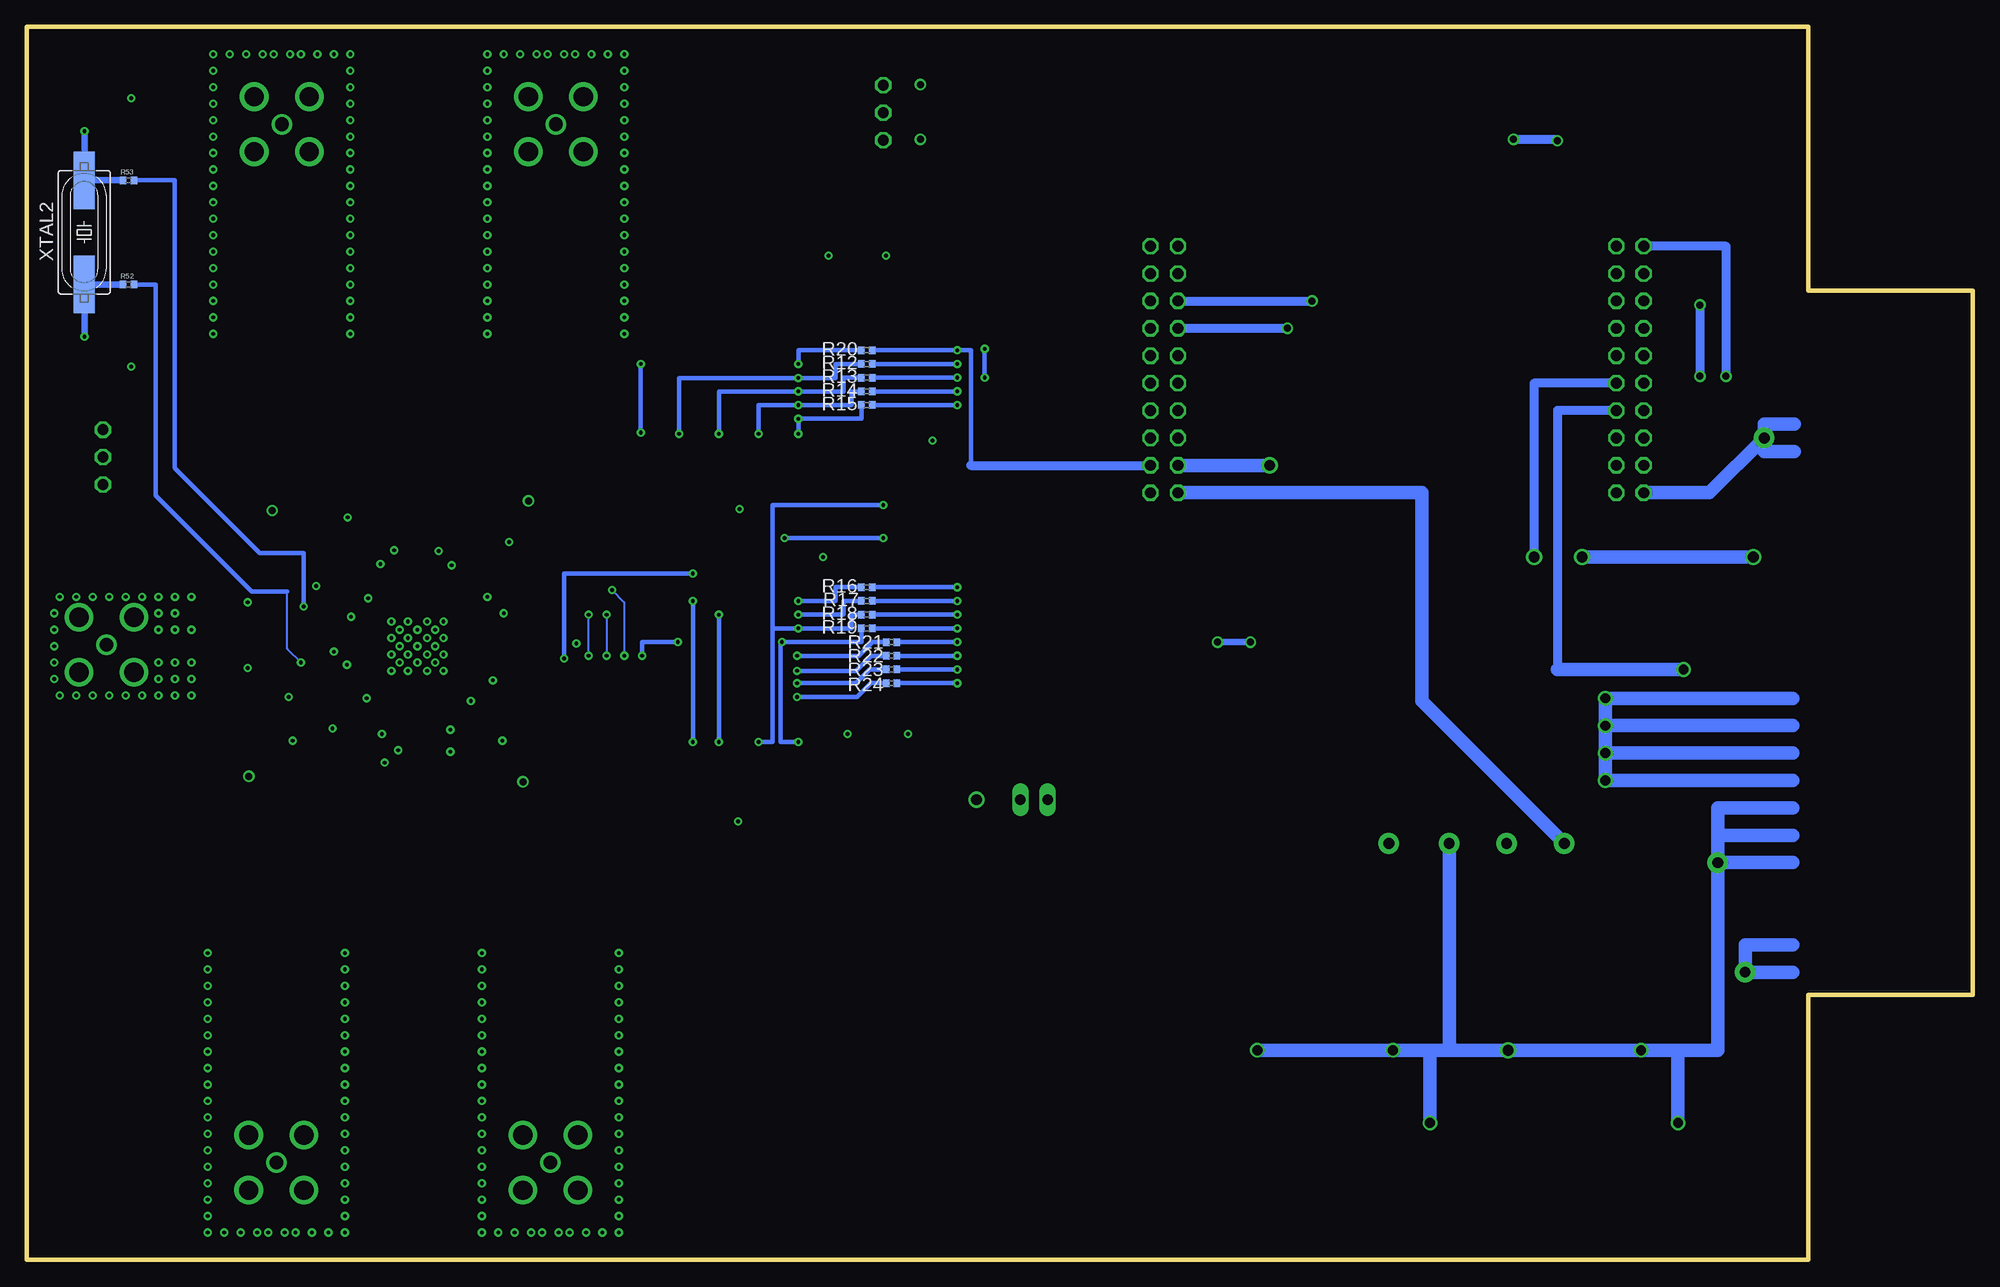
[diagram p6: board, bottom side, seen from below]

Size 180.34 x 114.3 mm. Coordinates in mm from the lower left corner, seen from the top.
Outline: 180.34,0 180.34,114.3 15.24,114.3 15.24,89.85 0,89.85 0,24.57 15.24,24.57 15.24,0 180.34,0
Copper layers ([2:[15:1+2*15+16]]): Top 0.01778125mm / dielectric 12mil / Route2 0.01778125mm / dielectric 39mil / Route15 0.01778125mm / dielectric 12mil / Bottom 0.01778125mm
Design rules "default *": minimum track width 6mil, minimum drill 0.35mm, track to track 6mil, track to pad 6mil, pad to pad 6mil, via to via 6mil, smd to smd 6mil, copper to edge 40mil, drill to drill 6mil, minimum pad ring 10mil, minimum via ring 8mil, stop-mask expansion 4mil, vias tented up to drill 0mil, thermal gap 10mil

### Footprints (pad centres in the part's own frame; a part is rotated, then mirrored left to right if it is on the bottom)
C0402 = smd 0.7 x 0.9: 1 -0.65,0; 2 0.65,0
CT3528 = smd 2 x 2.2: + -1.5,0; - 1.5,0
C0603 = smd 1.1 x 1: 1 -0.85,0; 2 0.85,0
C0805 = smd 1.3 x 1.5: 1 -0.95,0; 2 0.95,0
D-PAK_TO252AA = smd 1 x 1.6: 1 -2.28,-4.8; 3 2.28,-4.8 | smd 5.4 x 6.2: 4 0,2.5
BU-SMA-V = drill 1.27: 1 0,0 | drill 1.778: 2 -2.55,2.55; 3 2.55,2.55; 4 2.55,-2.55; 5 -2.55,-2.55
0402 = smd 0.7 x 0.9: 1 -0.65,0; 2 0.65,0
R0603 = smd 1 x 1.1: 1 -0.85,0; 2 0.85,0
R0402 = smd 0.6 x 0.7: 1 -0.5,0; 2 0.5,0
SM22 = smd 0.762 x 1.397: 1 -1.27,1.714; 2 0,1.714; 3 1.27,1.714; 4 1.27,-1.714; 5 -1.27,-1.714
ADTT = smd 1.651 x 2.54: 1 0,0.254; 2 2.54,0.254; 3 5.08,0.254; 4 5.08,5.334; 5 2.54,5.334; 6 0,5.334
CP_56_1_ADI = smd 0.813 x 0.203: 1 -3.899,3.25; 2 -3.899,2.75; 3 -3.899,2.25; 4 -3.899,1.75; 5 -3.899,1.25; 6 -3.899,0.75; 7 -3.899,0.25; 8 -3.899,-0.25; 9 -3.899,-0.75; 10 -3.899,-1.25; 11 -3.899,-1.75; 12 -3.899,-2.25; 13 -3.899,-2.75; 14 -3.899,-3.25; 29 3.899,-3.25; 30 3.899,-2.75; 31 3.899,-2.25; 32 3.899,-1.75; 33 3.899,-1.25; 34 3.899,-0.75; 35 3.899,-0.25; 36 3.899,0.25; 37 3.899,0.75; 38 3.899,1.25; 39 3.899,1.75; 40 3.899,2.25; 41 3.899,2.75; 42 3.899,3.25 | smd 0.203 x 0.813: 15 -3.25,-3.899; 16 -2.75,-3.899; 17 -2.25,-3.899; 18 -1.75,-3.899; 19 -1.25,-3.899; 20 -0.75,-3.899; 21 -0.25,-3.899; 22 0.25,-3.899; 23 0.75,-3.899; 24 1.25,-3.899; 25 1.75,-3.899; 26 2.25,-3.899; 27 2.75,-3.899; 28 3.25,-3.899; 43 3.25,3.899; 44 2.75,3.899; 45 2.25,3.899; 46 1.75,3.899; 47 1.25,3.899; 48 0.75,3.899; 49 0.25,3.899; 50 -0.25,3.899; 51 -0.75,3.899; 52 -1.25,3.899; 53 -1.75,3.899; 54 -2.25,3.899; 55 -2.75,3.899; 56 -3.25,3.899 | smd 6.248 x 6.248: 57 0,0
SO20W = smd 0.66 x 2.032: 1 -5.715,-5.029; 2 -4.445,-5.029; 3 -3.175,-5.029; 4 -1.905,-5.029; 5 -0.635,-5.029; 6 0.635,-5.029; 7 1.905,-5.029; 8 3.175,-5.029; 9 4.445,-5.029; 10 5.715,-5.029; 11 5.715,5.029; 12 4.445,5.029; 13 3.175,5.029; 14 1.905,5.029; 15 0.635,5.029; 16 -0.635,5.029; 17 -1.905,5.029; 18 -3.175,5.029; 19 -4.445,5.029; 20 -5.715,5.029
TSW-110-XX-G-D = drill 1 pad 1.5 octagon: 1 11.43,-1.27; 2 11.43,1.27; 3 8.89,-1.27; 4 8.89,1.27; 5 6.35,-1.27; 6 6.35,1.27; 7 3.81,-1.27; 8 3.81,1.27; 9 1.27,-1.27; 10 1.27,1.27; 11 -1.27,-1.27; 12 -1.27,1.27; 13 -3.81,-1.27; 14 -3.81,1.27; 15 -6.35,-1.27; 16 -6.35,1.27; 17 -8.89,-1.27; 18 -8.89,1.27; 19 -11.43,-1.27; 20 -11.43,1.27
TSW-103-XX-G-S = drill 1 pad 1.5 octagon: 1 2.54,0; 2 0,0; 3 -2.54,0
22-23-2021 = drill 1 long: 1 -1.27,0; 2 1.27,0
HC49UP = smd 5.334 x 1.93: 1 -4.826,0; 2 4.826,0

### Placement (x,y rotation side)
C1  158.24,94.23 180 top
C2  158.24,90.17 180 top
C3  158.24,98.3 180 top
C4  158.24,86.11 180 top
C5  155.19,94.23 180 top
C6  155.19,98.3 180 top
C7  155.19,90.17 180 top
C8  155.19,86.11 180 top
C9  157.48,88.14 90 top
C10  155.96,92.2 90 top
C11  131.06,26.16 270 top
C12  133.35,20.07 0 top
C13  133.35,16 0 top
C14  133.35,24.13 0 top
C15  130.3,20.07 0 top
C16  130.3,24.13 0 top
C17  130.3,16 0 top
C18  130.3,28.19 0 top
C19  131.06,18.03 270 top
C20  132.59,22.1 270 top
C21  154.94,57.15 180 top
C22  154.94,58.55 180 top
C23  33.78,12.7 180 top
C24  43.18,24.77 270 top
C25  56.77,12.7 180 top
C26  66.29,24.64 270 top
C27  101.47,48.77 180 top
C28  103.38,93.09 180 top
C34  157.48,96.27 90 top
C38  161.32,65.89 45 top
C44  152.02,44.2 135 top
C45  150.75,51.08 315 top
C46  138.81,47.12 180 top
C48  154.61,53.67 315 top
C49  151.89,61.21 45 top
C50  149.35,66.29 45 top
C51  138.81,49.15 180 top
C52  138.3,67.56 180 top
C53  148.08,67.56 45 top
C54  134.75,61.47 0 top
C55  152.45,53.42 315 top
C56  136.65,51.82 0 top
C57  138.3,65.41 180 top
C60  133.35,28.19 0 top
C62  133.35,57.15 180 top
C66  173.99,82.8 180 top
C67  173.99,107.7 180 top
C70  156.46,26.16 270 top
C71  158.75,20.07 0 top
C72  158.75,16 0 top
C73  158.75,24.13 0 top
C74  155.7,20.07 0 top
C75  155.7,24.13 0 top
C76  155.7,16 0 top
C77  155.7,28.19 0 top
C78  156.46,18.03 270 top
C79  157.99,22.1 270 top
C80  158.75,28.19 0 top
C81  132.08,88.14 90 top
C82  129.79,94.23 180 top
C83  129.79,98.3 180 top
C84  129.79,90.17 180 top
C85  132.84,94.25 180 top
C86  132.84,90.17 180 top
C87  132.84,98.3 180 top
C88  132.84,86.11 180 top
C89  132.08,96.27 90 top
C90  130.56,92.2 90 top
C91  129.79,86.11 180 top
IC1  33.02,27.94 0 top
IC2  56.01,27.94 0 top
J5  131.32,105.28 0 top
J6  156.72,105.28 0 top
J7  131.83,9.02 0 top
J8  157.23,9.02 0 top
J9  172.97,57.02 0 top
L1  131.06,22.1 90 top
L2  132.59,18.03 90 top
L3  132.59,26.16 90 top
L4  156.46,22.1 90 top
L5  157.99,18.03 90 top
L6  157.99,26.16 90 top
L7  132.08,92.2 270 top
L8  130.56,96.27 270 top
L9  130.56,88.14 270 top
L10  157.48,92.2 270 top
L11  155.96,96.27 270 top
L12  155.96,88.14 270 top
R1  132.21,72.26 180 top
R2  135.51,72.26 180 top
R3  157.61,72.26 0 top
R4  160.91,72.26 0 top
R5  136.02,42.04 0 top
R6  132.72,42.04 0 top
R7  161.42,42.04 0 top
R8  158.13,42.04 0 top
R9  156.72,63.5 0 top
R10  157.61,57.91 270 top
R11  154.15,49.68 135 top
R12  102.49,83.06 180 bottom
R13  102.49,81.79 180 bottom
R14  102.49,80.52 180 bottom
R15  102.49,79.25 180 bottom
R16  102.49,62.36 180 bottom
R17  102.49,61.09 180 bottom
R18  102.49,59.82 180 bottom
R19  102.49,58.55 180 bottom
R20  102.49,84.33 180 bottom
R21  100.2,57.28 180 bottom
R22  100.2,56.01 180 bottom
R23  100.2,54.74 180 bottom
R24  100.2,53.47 180 bottom
R29  112.52,73.28 90 top
R30  157.61,55.63 0 top
R31  157.61,60.2 180 top
R52  170.94,90.42 180 bottom
R53  170.94,100.08 180 bottom
R65  108.84,73.28 90 top
R66  116.2,73.28 90 top
R67  119.89,73.28 90 top
R68  119.89,44.58 90 top
R69  112.52,44.58 90 top
R70  108.84,44.58 90 top
R99  116.2,44.58 90 top
T1  162.81,58.29 90 top
T2  131.32,76.2 0 top
T3  156.72,76.2 0 top
T4  136.91,38.1 180 top
T5  162.31,38.1 180 top
U1  144.15,56.9 90 top
U5  101.47,83.69 270 top
U6  101.47,57.91 270 top
X1  74.93,82.55 270 top
X2  31.75,82.55 270 top
X3  173.3,74.42 270 top
X4  100.96,106.35 90 top
X5  86.99,42.67 0 top
XTAL2  175.03,95.26 90 bottom

### Tracks (layer width: path | path; a pad name or v marks a point on that pad's centre or on a via)
!BUFFER_EN
  Top 0.406: U5.1 94.49,89.41 94.49,96.14 103.89,96.14 108.46,96.14 108.46,88.14 U5.19 104.01,88.14 104.01,68.45 | U6.1 94.49,63.63 94.49,68.45 104.01,68.45 | U6.19 108.46,62.36 108.46,68.45 104.01,68.45
  Top 0.61: X4.2 103.89,106.35 103.89,96.14
!RST
  Top 0.813: X2.9 27.3,81.28 27.3,69.72 46.48,50.55 85.72,50.55 X5.1
+5V  (via drill 1 pad 1.91)
  Top 1.27: IC1.3 35.3,15.49 | 35.3,15.49 35.3,12.72 C23.+ | IC2.3 58.29,15.62 | 58.29,15.62 58.29,12.72 C25.+ | 35.3,15.49 58.16,15.49 58.29,15.62 | 35.3,15.49 21.08,15.49 v21.08,26.67 | v21.08,26.67 21.08,29.21 | 16.64,29.21 21.08,29.21 | 16.64,26.67 v21.08,26.67 | 21.08,29.21 30.48,38.61 v37.85,38.61
  Bottom 1.27: 16.64,26.67 v21.08,26.67 21.08,29.21 16.64,29.21 | v37.85,38.61 51.05,51.82 51.05,71.12 X1.1
AVDD  (via drill 0.35, 0.65, 1 pad 1.91)
  Top 0.203: U1.15 148.41,53.65 148.84,53.21 149.14,52.87 149.38,52.6 | U1.19 150.22,55.65 v150.69,55.18 C55.1 | U1.21 151.63,56.65 v151.89,56.39 C48.1 | U1.26 149.82,59.15 v150.31,59.63 C49.1 | v148.84,52.07 149.37,52.6 149.38,52.6 | U1.31 146.4,63.34 v147.57,64.52 C50.1 | U1.33 145.4,64.88 v146.3,65.79 C53.1 | U1.39 142.4,62.96 v140.97,64.39 139.95,65.41 C57.1 | U1.37 143.4,64.5 v142.18,65.72 140.34,67.56 C52.1 | U1.5 142.9,50.06 141.99,49.15 v141.1,49.15 C51.1 | U1.7 143.9,49.15 141.86,47.12 v141.1,47.12 C46.1 | U1.11 145.9,48.8 147.96,46.74 | 147.96,46.74 151.64,43.05 151.8,43.05 C44.1 | 149.38,52.6 149.38,52.45 C45.1 | 147.96,46.74 147.32,46.1 v147.19,46.1 | U1.55 137.57,54.15 v137.15,53.73 136,52.58 C56.1 136.13,51.82 | U1.45 138.47,59.15 137.67,59.94 v136.14,59.94 136.14,59.96 134.11,59.96 134.1,59.94 C54.1
  Top 0.711: R5.1 134.37,42.04 | R6.2 134.37,42.04 | T4.2 134.37,42.04 | R7.1 159.77,42.04 | 159.77,42.04 R8.2 | T5.2 159.77,42.04 | R4.1 159.26,72.26 | R3.2 159.26,72.26 | T3.2 159.26,72.26 | R1.1 133.86,72.26 | R2.2 133.86,72.26 | T2.2 133.86,72.26 | 159.26,72.26 159.26,71.12 v157.61,69.47 | 133.86,72.26 v133.86,70.36 | 159.77,42.04 v159.77,44.83 | 134.37,42.04 134.49,42.16 | 134.37,42.04 v134.37,44.32
  Top 1.27: C26.+ 66.29,30.44 | 66.29,30.44 IC2.4 | 66.29,30.44 66.29,38.61 v54.1,38.61
  pour Route15 (isolate 0.305): 50.29,0 50.29,41.15 117.73,41.15 117.86,41.02 121.41,41.02 121.41,114.3 180.34,114.3 180.34,0
CLK_MODE_SEL
  Top 0.203: U1.24 151.11,58.15 154.94,61.98 160.27,61.98
  Top 0.406: 160.27,61.98 170.18,71.88 170.18,74.42 X3.2
CSB  (via drill 0.35)
  Top 0.203: U1.47 136.55,58.15 136.14,58.55 120.9,58.55 120.9,56.01
  Top 0.406: 120.9,56.01 v108.97,56.01 U6.14
  Bottom 0.406: R21.2 101.98,57.28 103.25,56.01 v108.97,56.01
CSB_U  (via drill 0.35, 0.65)
  Top 0.406: U6.6 v94.11,57.28 90.3,57.28
  Top 0.61: 90.3,57.28 v69.98,57.28
  Top 0.813: v66.93,57.28 66.93,78.74 X1.7
  Bottom 0.406: R21.1 v94.11,57.28
  Bottom 0.61: v69.98,57.28 v66.93,57.28
DAC0_OUT
  Top 0.711: L12.2 156.72,87.49 | 156.72,87.49 C9.1 | 156.72,86.11 156.72,87.49
  Top 0.813: T3.6 156.72,86.11
  Top 0.889: C8.1 156.72,86.11 C4.2
DAC1_OUT
  Top 0.711: L9.2 131.32,87.49 | 131.32,87.49 C81.1 | 131.32,87.49 131.32,86.11
  Top 0.813: T2.6 131.32,86.11
  Top 0.889: C91.1 131.32,86.11 C88.2
DAC2_OUT
  Top 0.711: C11.1 131.83,26.81 | 131.83,26.81 L3.2 | 131.83,28.19 131.83,26.81
  Top 0.813: T4.4 131.83,28.19
  Top 0.889: C18.2 131.83,28.19 C60.1
DAC3_OUT
  Top 0.711: C70.1 157.23,26.81 | 157.23,26.81 L6.2 | 157.23,28.19 157.23,26.81
  Top 0.813: T5.4 157.23,28.19
  Top 0.889: C77.2 157.23,28.19 C80.1
GND  (via drill 0.35, 0.65, 0.9, 1, 1 pad 1.91)
  Top 0.203: U1.16 148.8,54.15 151.64,51.31 151.64,51.05 C45.2 | U1.18 149.58,55.15 152.27,52.45 152.41,52.45 C55.2 153.48,53.53 | U1.20 150.86,56.15 153.48,53.53 | C48.2 154.56,52.7 154.31,52.7 153.48,53.53 | U1.25 150.85,58.65 152.91,60.71 152.91,61.12 C49.2 | U1.28 148.72,60.15 v148.72,61.34 | U1.32 145.9,64.11 149.16,67.37 | 149.23,67.31 149.25,67.31 | 149.23,67.31 149.23,67.34 | U1.34 144.9,65.77 147.83,68.71 147.86,68.71 C53.2 148.54,67.99 149.16,67.37 | U1.38 142.9,63.61 139.95,66.55 137.67,66.55 | 137.67,66.55 137.65,66.56 | 137.67,66.55 137.65,66.53 C57.2 | U1.6 143.4,49.67 141.86,48.13 138.18,48.13 | 138.18,48.13 138.18,49.13 C51.2 | C46.2 138.16,48.12 138.18,48.13 | U1.12 146.4,49.82 v147.45,48.77 C44.2 | U1.10 145.4,47.77 v145.92,47.24 | C52.2 137.67,67.55 137.67,66.55 | U1.44 139.06,59.65 139.06,61.47 v137.67,61.47 C54.2 | U1.56 139.19,53.65 v139.19,51.82 C56.2 | C50.2 149.78,66.75 149.23,67.31 | 149.23,67.31 149.16,67.37
  Top 0.406: R11.1 v155.7,48.13 | v155.7,48.13 | C38.2 168.4,72.97 168.4,76.96 X3.3 | C48.2 v156.08,52.2 | v156.08,52.2 | C49.2 153.16,62.48 v153.54,62.48 | v150.62,68.83 149.16,67.37 | 137.67,66.55 v135.64,66.55 | C45.2 152.02,49.81 v152.02,49.28 | 138.18,48.13 v136.27,48.13 | C62.2 v129.41,57.15 | 102.53,85.6 102.53,77.98 U5.10 96.39,77.98 v96.39,75.95 | 102.53,85.6 102.53,86.87 | 102.53,86.87 102.53,88.14 | 102.53,88.14 C28.2 v100.71,93.09 | U5.4 102.53,85.6 | U5.3 102.53,86.87 | U5.2 102.53,88.14 | U6.10 100.62,52.2 C27.2 v98.68,48.77 | R65.1 R29.1 114.3,72.43 | 114.3,72.43 R66.1 R67.1 | 114.3,72.43 v114.3,69.6 | R70.1 R69.1 114.43,43.73 | 114.43,43.73 R99.1 R68.1 | 114.43,43.73 v114.43,40.64 | R31.1 158.11,60.96 v159.89,60.96 | R30.2 158.11,54.86 v159.89,54.86
  Top 0.61: C67.2 v170.69,107.7 | C66.2 v170.69,82.8 | X4.3 97.54,103.81 v97.54,103.89
  Top 0.813: T2.4 136.4,86.11 C88.1 | T3.4 161.8,86.11 C4.1 | T4.6 136.91,28.19 C60.2 | T5.6 162.31,28.19 C80.2
  Top 1.27: IC1.1 v30.74,19.43 v30.73,19.43 | v53.72,19.43 IC2.1 | v66.29,19.43 C26.- | C23.- v27.3,12.7 | C25.- v50.29,12.7 | 16.64,36.83 v23.62,36.83 23.62,39.37 | 23.62,39.37 16.64,39.37 | 16.51,77.47 19.3,77.47 v19.3,76.2 19.3,74.93 16.51,74.93 | C24.- 43.05,23.27 v43.05,19.43 | 16.64,41.91 23.62,41.91 23.62,39.37 | v92.33,42.67 X5.2
  Bottom 1.27: 48.51,19.43 v43.05,19.43 v30.73,19.43 27.3,19.43 | 48.51,19.43 50.29,19.43 | 50.29,19.43 v53.72,19.43 v66.29,19.43 | v27.3,12.7 27.3,19.43 | v50.29,12.7 50.29,19.43 | 48.51,19.43 v48.51,38.61 | 27.3,19.43 23.62,19.43 v23.62,36.83 | v23.62,36.83 16.64,36.83 | v23.62,36.83 23.62,39.37 | 23.62,39.37 16.64,39.37 | 16.51,77.47 19.3,77.47 v19.3,76.2 | v19.3,76.2 19.3,74.93 16.51,74.93 | X2.1 24.38,71.12 v19.3,76.2 | 16.64,44.45 v34.04,44.45 v34.04,46.99 | 16.64,46.99 v34.04,46.99 | 16.64,49.53 v34.04,49.53 | 16.64,41.91 23.62,41.91 23.62,39.37 | v34.04,49.53 v34.04,52.07 16.64,52.07 | v34.04,49.53 v34.04,46.99 | X1.3 v65.15,73.66
  other vias: 124.97,111.76 137.67,111.76 126.49,111.76 128.02,111.76 136.14,111.76 134.62,111.76 133.1,111.76 129.54,111.76 132.08,111.76 130.56,111.76 124.97,110.24 124.97,108.71 124.97,107.19 124.97,105.66 124.97,104.14 124.97,102.62 137.67,110.24 137.67,108.71 137.67,107.19 137.67,105.66 137.67,104.14 137.67,102.62 124.97,101.09 137.67,101.09 124.97,99.57 137.67,99.57 124.97,98.04 124.97,96.52 124.97,95 124.97,93.47 124.97,91.95 124.97,90.42 124.97,88.9 124.97,87.38 124.97,85.85 137.67,98.04 137.67,96.52 137.67,95 137.67,93.47 137.67,91.95 137.67,90.42 137.67,88.9 137.67,87.38 137.67,85.85 150.37,111.76 163.07,111.76 151.89,111.76 153.42,111.76 161.54,111.76 160.02,111.76 158.5,111.76 154.94,111.76 157.48,111.76 155.96,111.76 150.37,110.24 150.37,108.71 150.37,107.19 150.37,105.66 150.37,104.14 150.37,102.62 163.07,110.24 163.07,108.71 163.07,107.19 163.07,105.66 163.07,104.14 163.07,102.62 150.37,101.09 163.07,101.09 150.37,99.57 163.07,99.57 150.37,98.04 150.37,96.52 150.37,95 150.37,93.47 150.37,91.95 150.37,90.42 150.37,88.9 150.37,87.38 150.37,85.85 163.07,98.04 163.07,96.52 163.07,95 163.07,93.47 163.07,91.95 163.07,90.42 163.07,88.9 163.07,87.38 163.07,85.85 163.58,2.54 150.88,2.54 162.05,2.54 160.53,2.54 152.4,2.54 153.92,2.54 155.45,2.54 159,2.54 156.46,2.54 157.99,2.54 163.58,4.06 163.58,5.59 163.58,7.11 163.58,8.64 163.58,10.16 163.58,11.68 150.88,4.06 150.88,5.59 150.88,7.11 150.88,8.64 150.88,10.16 150.88,11.68 163.58,13.21 150.88,13.21 163.58,14.73 150.88,14.73 163.58,16.26 163.58,17.78 163.58,19.3 163.58,20.83 163.58,22.35 163.58,23.88 163.58,25.4 163.58,26.92 163.58,28.45 150.88,16.26 150.88,17.78 150.88,19.3 150.88,20.83 150.88,22.35 150.88,23.88 150.88,25.4 150.88,26.92 150.88,28.45 138.18,2.54 125.48,2.54 136.65,2.54 135.13,2.54 127,2.54 128.52,2.54 130.05,2.54 133.6,2.54 131.06,2.54 132.59,2.54 138.18,4.06 138.18,5.59 138.18,7.11 138.18,8.64 138.18,10.16 138.18,11.68 125.48,4.06 125.48,5.59 125.48,7.11 125.48,8.64 125.48,10.16 125.48,11.68 138.18,13.21 125.48,13.21 138.18,14.73 125.48,14.73 138.18,16.26 138.18,17.78 138.18,19.3 138.18,20.83 138.18,22.35 138.18,23.88 138.18,25.4 138.18,26.92 138.18,28.45 125.48,16.26 125.48,17.78 125.48,19.3 125.48,20.83 125.48,22.35 125.48,23.88 125.48,25.4 125.48,26.92 125.48,28.45 177.29,61.47 177.29,52.32 177.8,59.94 177.8,58.42 177.8,56.9 177.8,55.37 177.8,53.85 175.77,61.47 174.24,61.47 172.72,61.47 171.2,61.47 169.67,61.47 168.15,61.47 166.62,61.47 165.1,61.47 175.77,52.32 174.24,52.32 172.72,52.32 171.2,52.32 169.67,52.32 168.15,52.32 166.62,52.32 165.1,52.32 168.15,53.85 168.15,55.37 166.62,53.85 165.1,53.85 165.1,55.37 166.62,55.37 166.62,59.94 166.62,58.42 168.15,59.94 168.15,58.42 165.1,58.42 141.73,59.18 146.56,59.18 146.56,54.61 141.73,54.61 143.26,59.18 145.03,59.18 143.26,54.61 145.03,54.61 141.73,56.13 141.73,57.66 146.56,56.13 146.56,57.66 143.26,56.13 145.03,56.13 145.03,57.66 143.26,57.66 142.49,55.37 142.49,56.9 142.49,58.42 145.8,58.42 145.8,56.9 145.8,55.37 144.15,58.42 144.15,56.9 144.15,55.37
  pour Route2 (isolate 0.305): 19.3,0 19.3,114.3 180.34,114.3 180.34,0
  pour Top (isolate 0.305): 129.29,85.09 129.29,100.33 127.76,100.33 126.49,100.33 126.49,108.46 126.49,110.24 133.1,110.24 136.14,110.24 136.14,106.68 136.14,100.33 134.37,100.33 133.35,100.33 133.35,97.28 133.35,85.09 139.19,85.09 139.19,105.66 139.19,113.28 132.33,113.28 123.44,113.28 123.44,108.2 123.44,85.09
  pour Top (isolate 0.305): 154.69,85.09 154.69,100.33 153.16,100.33 151.89,100.33 151.89,108.46 151.89,110.24 158.5,110.24 161.54,110.24 161.54,106.68 161.54,100.33 159.77,100.33 158.75,100.33 158.75,97.28 158.75,85.09 164.59,85.09 164.59,105.66 164.59,113.28 157.73,113.28 148.84,113.28 148.84,108.2 148.84,85.09
  pour Top (isolate 0.305): 159.26,29.21 159.26,13.97 160.78,13.97 162.05,13.97 162.05,5.84 162.05,4.06 155.45,4.06 152.4,4.06 152.4,7.62 152.4,13.97 154.18,13.97 155.19,13.97 155.19,17.02 155.19,29.21 149.35,29.21 149.35,8.64 149.35,1.02 156.21,1.02 165.1,1.02 165.1,6.1 165.1,29.21
  pour Top (isolate 0.305): 133.86,29.21 133.86,13.97 135.38,13.97 136.65,13.97 136.65,5.84 136.65,4.06 130.05,4.06 127,4.06 127,7.62 127,13.97 128.78,13.97 129.79,13.97 129.79,17.02 129.79,29.21 123.95,29.21 123.95,8.64 123.95,1.02 130.81,1.02 139.7,1.02 139.7,6.1 139.7,29.21
  pour Top (isolate 0.305): 163.32,51.31 163.32,62.74 178.56,62.74 178.56,51.31
I/O_UPDATE  (via drill 0.35)
  Top 0.203: U1.46 136.81,58.65 136.27,59.18 132.59,59.18 131.44,60.33
  Top 0.406: 131.44,60.33 123.44,68.33 v123.44,76.71 | v123.44,83.06 v108.84,83.06 U5.15
  Bottom 0.406: v123.44,83.06 v123.44,76.71 | R20.2 108.84,84.33 v108.84,83.06
I/O_UPDATE_U  (via drill 0.35)
  Top 0.406: U5.5 v94.11,84.33
  Bottom 0.406: 92.84,73.66 92.84,84.33 v94.11,84.33 R20.1
  Bottom 0.813: 92.84,73.66 X1.4
LDAC_CARDEDGE  (via drill 0.65)
  Top 0.813: X2.17 25.65,91.44 25.27,91.06 v25.27,88.52 | 29.97,44.45 30.1,44.58 30.1,59.31 25.27,64.14 v25.27,81.92
  Top 1.27: 16.64,44.45 29.97,44.45
  Bottom 0.813: v25.27,88.52 v25.27,81.92
N$1
  Top 0.406: R30.1 156.34,55.63 155.59,56.37 C21.1 156.46,57.15 156.59,57.02 157.57,57.02 R10.2 161.06,57.06 T1.1
N$3
  Top 0.203: U1.8 144.4,48.51 141.48,45.59
  Top 0.406: 141.48,45.59 131.87,45.59 R6.1
  Top 0.711: R6.1 131.87,37.85 T4.3
N$4
  Top 0.203: U1.9 144.9,45.45 141.48,42.04
  Top 0.406: 141.48,42.04 R5.2
  Top 0.711: R5.2 136.87,37.85 T4.1
N$5
  Top 0.203: U1.29 147.4,61.54 152.4,66.55
  Top 0.406: 152.4,66.55 157.23,66.55 161.8,71.12 161.8,72.22 R4.2
  Top 0.711: T3.3 161.8,72.26 R4.2
N$6
  Top 0.203: U1.36 143.9,65.78 142.62,67.06 140.59,69.09
  Top 0.406: 140.59,69.09 131.32,69.09 131.32,72.26
  Top 0.711: T2.1 131.32,72.26 R1.2
N$7
  Top 0.203: U1.17 149.19,54.65 R11.2
N$8
  Top 0.203: 155.74,63.37 155.61,63.5 152.78,63.5 148.93,59.65 U1.27
  Top 0.406: 155.74,63.37 R9.1
N$9
  Top 0.406: R9.2 158.93,63.5 C38.1
N$11
  Top 0.203: U1.14 147.4,52.25 150.11,49.53
  Top 0.406: 150.11,49.53 152.91,46.74 162.05,46.74 162.31,46.48 162.31,42.04
  Top 0.711: T5.1 162.31,42.04 R7.2
N$13
  Top 0.711: C90.1 131.32,91.55 | 131.32,91.55 L7.2 | L9.1 131.32,88.79 | 131.32,88.79 C81.2 | 131.32,91.55 131.32,90.17 131.32,88.79
  Top 0.889: C84.1 131.32,90.17 C86.2
N$15
  Top 0.711: L8.1 131.32,96.92 | 131.32,96.92 C89.2 | 131.32,98.3 131.32,96.92
  Top 0.813: J5.1 131.32,98.3
  Top 0.889: C83.1 131.32,98.3 C87.2
N$16
  Top 0.711: L8.2 131.32,95.62 | 131.32,95.62 C89.1 | C90.2 131.32,92.85 | 131.32,92.85 L7.1 | 131.32,95.62 131.32,94.23 131.32,92.85
  Top 0.889: C82.1 131.32,94.23 132.18,94.23 C85.2
N$17  (via drill 0.35)
  Top 0.61: C66.1 174.94,85.53 v175.01,85.6
  Bottom 0.61: R52.2 175.02,90.42 XTAL2.1 175.01,90.41 v175.01,85.6
N$21
  Top 0.203: 152.15,67.56 146.9,62.31 U1.30
  Top 0.406: 152.15,67.56 154.43,69.85 155.45,69.85 156.76,71.16 R3.1
  Top 0.711: T3.1 156.72,72.26 R3.1
N$26  (via drill 0.35)
  Top 0.61: C67.1 174.94,104.71 v175.01,104.65
  Bottom 0.61: R53.2 171.46,100.09 XTAL2.2 175.01,100.11 v175.01,104.65
N$29  (via drill 0.35)
  Top 0.203: U1.22 C21.2 154.29,56.02 v154.94,55.37
  Bottom 0.203: v154.94,55.37 156.21,56.64 156.21,61.98
  Bottom 0.406: 156.21,61.98 159.51,61.98 168.4,70.87 168.4,90.42 R52.1
N$31
  Top 0.406: R31.2 156.46,60.2 155.59,59.32 C22.1 156.59,58.55 156.81,58.76 R10.1 158.97,58.76 159.77,59.56 T1.3
N$32
  Top 0.61: T1.5 J9.1
N$33  (via drill 0.35)
  Top 0.203: U1.23 151.63,57.65 152.53,58.55 C22.2
  Top 0.406: C22.2 154.29,60.18 v154.69,60.58
  Bottom 0.406: R53.1 166.62,100.08 166.62,73.41 158.75,65.53 154.69,65.53 v154.69,60.58
N$34
  Top 0.711: C19.2 131.83,17.38 | 131.83,17.38 L2.1 | 131.83,16 131.83,17.38
  Top 0.813: J7.1 131.83,16
  Top 0.889: C17.2 131.83,16 C13.1
N$35
  Top 0.711: L12.1 156.72,88.79 | 156.72,88.79 C9.2 | C10.1 156.72,91.55 | 156.72,91.55 L10.2 | 156.72,91.55 156.72,90.17 156.72,88.79
  Top 0.889: C2.2 156.72,90.17 C7.1
N$36
  Top 0.711: L11.1 156.59,96.92 | 156.59,96.92 C34.2 | 156.72,98.3 156.72,97.04 156.59,96.92
  Top 0.813: J6.1 156.72,98.3
  Top 0.889: C6.1 156.72,98.3 C3.2
N$37
  Top 0.711: L11.2 156.72,95.62 | 156.72,95.62 C34.1 | 156.72,95.62 156.72,94.23 156.72,92.85 | C10.2 156.72,92.85 | 156.72,92.85 L10.1
  Top 0.889: C5.1 156.72,94.23 C1.2
N$41
  Top 0.203: U1.13 146.9,51.86 147.89,50.86 147.96,50.8 148.84,49.91 148.84,49.02
  Top 0.406: 148.84,49.02 153.92,43.94 157.23,43.94 157.23,42.04
  Top 0.711: T5.3 157.23,42.04 R8.1
N$45
  Top 0.203: 140.84,72.26 144.4,68.71 U1.35
  Top 0.406: 140.84,72.26 136.4,72.26
  Top 0.711: T2.3 136.4,72.26 R2.1
N$48
  Top 0.711: C11.2 131.83,25.51 | 131.83,25.51 L3.1 | L1.2 131.83,22.75 | 131.83,22.75 C20.1 | 131.83,25.51 131.83,24.13 131.83,22.75
  Top 0.889: C16.2 131.83,24.13 C14.1
N$50
  Top 0.711: L1.1 131.83,21.45 | 131.83,21.45 C20.2 | C19.1 131.83,18.68 | 131.83,18.68 L2.2 | 131.83,21.45 131.83,20.07 131.83,18.68
  Top 0.889: C15.2 131.83,20.07 C12.1
N$56
  Top 0.711: L4.2 157.23,22.75 | 157.23,22.75 C79.1 | 157.23,22.75 157.23,24.13 157.23,25.51 | C70.2 157.23,25.51 | 157.23,25.51 L6.1
  Top 0.889: C75.2 157.23,24.13 C73.1
N$57
  Top 0.711: C78.2 157.23,17.38 | 157.23,17.38 L5.1 | 157.23,16 157.23,17.38
  Top 0.813: J8.1 157.23,16
  Top 0.889: C76.2 157.23,16 C72.1
N$58
  Top 0.711: C78.1 157.23,18.68 | 157.23,18.68 L5.2 | 157.23,18.68 157.23,20.07 157.23,21.45 | L4.1 157.23,21.45 | 157.23,21.45 C79.2
  Top 0.889: C74.2 157.23,20.07 C71.1
P0  (via drill 0.35)
  Top 0.203: U1.40 141.9,62.57 140.34,64.13 140.08,64.39 132.97,64.39 128.52,68.83
  Top 0.406: U5.14 106.5,81.76 v108.84,81.76 128.52,81.76 128.52,68.83 | v119.89,76.58 R67.2
  Bottom 0.406: R12.2 105.41,83.06 105.41,81.76 v108.84,81.76 119.89,81.76 v119.89,76.58
P0_U  (via drill 0.35)
  Top 0.406: U5.6 v94.11,83.06 90.04,83.06 90.04,85.09
  Top 0.813: 90.04,85.09 90.04,107.44 21.72,107.44 21.72,86.36 X2.13
  Bottom 0.406: v94.11,83.06 R12.1
P1  (via drill 0.35)
  Top 0.203: U1.41 141.4,62.31 139.83,63.88 132.21,63.88 127.25,68.83
  Top 0.406: U5.13 v108.84,80.52 127.25,80.52 127.25,68.83 | v116.2,76.58 R66.2
  Bottom 0.406: R13.2 104.65,81.79 104.65,80.52 v108.84,80.52 116.2,80.52 v116.2,76.58
P1_U  (via drill 0.35)
  Top 0.406: U5.7 v94.11,81.79 v91.57,81.79 | v91.57,84.45 91.57,85.09
  Top 0.813: 91.57,85.09 91.57,109.22 19.43,109.22 19.43,83.82 X2.11
  Bottom 0.406: v94.11,81.79 R13.1 | v91.57,84.45 v91.57,81.79
P2  (via drill 0.35)
  Top 0.203: U1.42 140.9,62.05 139.57,63.37 131.44,63.37 125.98,68.83
  Top 0.406: U5.12 v108.84,79.25 125.98,79.25 125.98,68.83 | v112.52,76.58 R29.2
  Bottom 0.406: R14.2 103.89,80.52 103.89,79.25 v108.84,79.25 112.52,79.25 v112.52,76.58
P2_U  (via drill 0.35)
  Top 0.406: U5.8 v94.11,80.52 87.88,80.52 87.88,85.09
  Top 0.813: 87.88,85.09 87.88,105.66 40.64,105.66 40.64,71.12 X2.2
  Bottom 0.406: v94.11,80.52 R14.1
P3  (via drill 0.35)
  Top 0.203: U1.43 139.7,60.15 139.7,62.1 138.94,62.87 130.56,62.87 124.71,68.71
  Top 0.406: U5.11 v108.84,77.98 124.71,77.98 124.71,68.71 | v108.84,76.58 R65.2
  Bottom 0.406: R15.2 102.99,77.98 v108.84,77.98 v108.84,76.58
P3_U  (via drill 0.35, 0.65)
  Top 0.406: U5.9 v94.11,79.25 85.72,79.25 85.72,85.09
  Top 0.813: 85.72,85.09 85.72,103.89 v42.55,103.89 | v38.48,103.76 38.48,73.66 X2.4
  Bottom 0.406: v94.11,79.25 R15.1
  Bottom 0.813: v42.55,103.89 38.61,103.89 v38.48,103.76
PWR_DWN  (via drill 0.35)
  Top 0.203: U1.4 142.4,50.83 141.6,50.04 120.9,50.04 120.9,52.2
  Top 0.406: 120.9,52.2 v108.97,52.2 U6.11
  Bottom 0.406: R24.2 102.11,53.47 103.38,52.2 v108.97,52.2
PWR_DWN_U  (via drill 0.35, 0.65)
  Top 0.406: U6.9 v94.11,53.47 90.3,53.47
  Top 0.61: 90.3,53.47 61.21,53.47
  Top 0.813: v61.21,88.9 61.21,53.47
  Bottom 0.406: R24.1 v94.11,53.47
  Bottom 0.813: X1.15 v61.21,88.9
RESET  (via drill 0.35)
  Top 0.203: U1.3 141.9,51.09 141.35,50.55 122.43,50.55 122.43,53.47
  Top 0.406: 122.43,53.47 v108.97,53.47 U6.12
  Bottom 0.406: R23.2 102.23,54.74 103.5,53.47 v108.97,53.47
RESET_U  (via drill 0.35, 0.65)
  Top 0.406: U6.8 v94.11,54.74 90.3,54.74
  Top 0.61: 90.3,54.74 63.5,54.74
  Top 0.813: v63.5,86.36 63.5,54.74
  Bottom 0.406: R23.1 v94.11,54.74
  Bottom 0.813: X1.13 v63.5,86.36
SCLK  (via drill 0.35)
  Top 0.203: U1.48 136.28,57.65 135.89,58.04 122.43,58.04 122.43,54.61
  Top 0.406: 122.43,54.61 v108.97,54.61 106.63,54.61 U6.13
  Bottom 0.406: R22.2 102.11,56.01 103.5,54.61 v108.97,54.61
SCLK_U  (via drill 0.35)
  Top 0.406: U6.7 v94.11,56.01 90.3,56.01
  Top 0.61: 90.3,56.01 68.45,56.01
  Top 0.813: 68.45,56.01 68.45,76.2 X1.5
  Bottom 0.406: R22.1 v94.11,56.01
SDIO_0  (via drill 0.35)
  Top 0.203: U1.50 136.28,56.65 134.37,54.74 128.27,54.74 v128.27,56.01
  Top 0.406: v128.27,59.82 128.27,61.09 v118.62,61.09 v108.84,61.09 U6.18 | R68.2 119.89,48.01 v118.62,48.01
  Bottom 0.203: v128.27,56.01 v128.27,59.82
  Bottom 0.406: v108.84,61.09 105.41,61.09 105.41,62.36 R16.2 | v118.62,48.01 v118.62,61.09
SDIO_0_U  (via drill 0.35)
  Top 0.406: U6.2 v94.11,62.36 81.41,75.06 81.41,85.09
  Top 0.813: 81.41,85.09 81.41,100.33 66.93,100.33 66.93,83.82 X1.11
  Bottom 0.406: v94.11,62.36 R16.1
SDIO_1  (via drill 0.35)
  Top 0.203: v126.62,56.01 126.62,53.98 134.37,53.98 136.54,56.15 U1.51
  Top 0.406: v126.62,59.82 v116.2,59.82 v108.84,59.82 U6.17 | R99.2 v116.2,48.01
  Bottom 0.203: v126.62,59.82 v126.62,56.01
  Bottom 0.406: v108.84,59.82 104.65,59.82 104.65,61.09 R17.2 | v116.2,48.01 v116.2,59.82
SDIO_1_U  (via drill 0.35)
  Top 0.406: U6.3 v94.11,61.09
  Bottom 0.406: v94.11,61.09 R17.1
SDIO_2  (via drill 0.35)
  Top 0.406: U6.16 v108.84,58.55 | v112.52,48.01 R69.2 | 83.57,85.09 83.57,76.71 90.3,69.98 v100.96,69.98
  Top 0.813: X1.9 65.41,81.28 65.41,102.11 83.57,102.11 83.57,85.09
  Bottom 0.406: R18.2 103.89,59.82 103.89,58.55 v108.84,58.55 111.25,58.55 | v100.96,69.98 111.25,69.98 111.25,58.55 | 111.25,58.55 111.25,48.01 v112.52,48.01
SDIO_2_U  (via drill 0.35)
  Top 0.203: U1.52 136.8,55.65 134.37,53.21 124.97,53.21 v124.97,56.01
  Top 0.406: v100.96,66.93 100.96,59.82 U6.4 v94.11,59.82 | v110.11,66.93 121.28,66.93 v126.11,62.1
  Bottom 0.203: v126.11,62.1 124.97,60.96 v124.97,56.01
  Bottom 0.406: v100.96,66.93 v110.11,66.93 | v94.11,59.82 R18.1
SDIO_3  (via drill 0.35)
  Top 0.203: U1.53 137.06,55.15 134.37,52.45 123.32,52.45 v123.32,56.01
  Top 0.406: v120.02,57.28 v110.36,57.28 U6.15 | v108.84,48.01 R70.2
  Bottom 0.406: v123.32,56.01 123.32,57.28 v120.02,57.28 | R19.2 102.99,57.28 v110.36,57.28 110.49,57.15 110.49,48.01 v108.84,48.01
SDIO_3_U  (via drill 0.35)
  Top 0.406: U6.5 v94.11,58.55 92.96,58.55 79.25,72.26 79.25,85.09
  Top 0.813: 79.25,85.09 79.25,98.55 68.45,98.55 68.45,91.44 X1.17
  Bottom 0.406: v94.11,58.55 R19.1
START_CARDEDGE  (via drill 0.65)
  Top 0.813: v22.86,81.92 22.86,49.53
  Top 1.27: 16.64,49.53 22.86,49.53
  Bottom 0.813: X2.19 22.86,93.98 v22.86,81.92
UART_RX_CARDEDGE  (via drill 0.9)
  Top 1.27: 16.64,46.99 26.8,46.99 v26.8,54.74
  Bottom 0.813: X2.8 38.48,78.74 38.48,54.74
  Bottom 1.27: 38.48,54.74 v26.8,54.74
UART_TX_CARDEDGE  (via drill 1)
  Top 1.27: v36.2,65.15 v40.64,65.15 | v20.32,65.15 20.32,52.07 16.64,52.07
  Bottom 0.813: X2.10 40.64,81.28 v40.64,65.15
  Bottom 1.27: v20.32,65.15 v36.2,65.15
VCC_I/O  (via drill 0.35, 0.65, 1 pad 1.91)
  Top 0.203: U1.49 C62.1 134,55.75 v130.56,55.75
  Top 0.406: U5.20 104.23,89.41 C28.1 v106.05,93.09 | v104.27,48.77 C27.1 102.32,63.63 U6.20 106.5,65.15 v106.55,65.15
  Top 0.61: X4.1 97.54,108.89 v97.54,108.97
  Top 1.27: C24.+ 43.18,30.44 | 43.18,30.44 IC1.4 | 43.18,30.44 v43.18,38.61
  Bottom 0.406: v130.56,55.75 130.56,63.63 v118.62,63.63
  pour Route15 (isolate 0.305): 18.8,0 18.8,114.3 119.89,114.3 119.89,43.94 46.86,43.94 46.86,0

### Text on the board
tNames: DISABLE | ENABLE | REF CLK | CRYSTAL | TIVA LAUNCHPAD | +5V | +3.3V | GND | +1.8V | 4 OUTPUT DDS v2.0 6/17/2021